# Altium project Automated Component Testing PCB.PrjPcb (part 1 of 2)
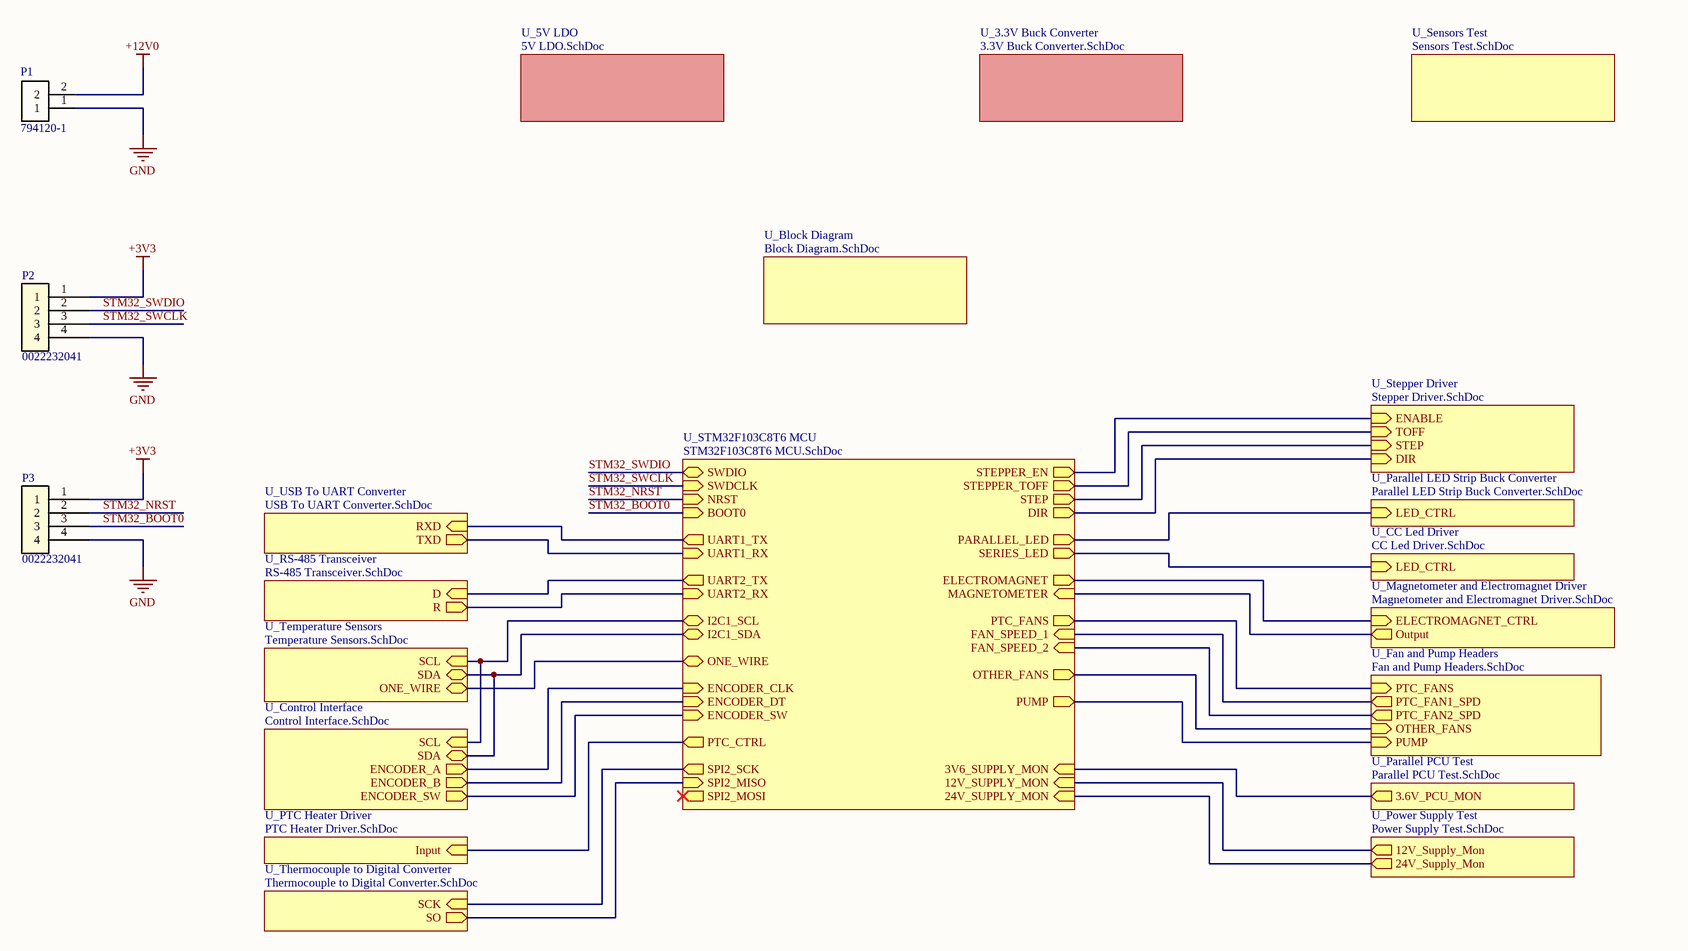
[diagram p0: Main.SchDoc]
Revision: A; Author: Hany Hamza
19 sheets, 184 parts. Net scope: hierarchical (ports join the sheet entries above them; power ports are global).
Board file: Component Testing PCB.PcbDoc
Sheets:
  Main.SchDoc
    U_3.3V Buck Converter = 3.3V Buck Converter.SchDoc
    U_5V LDO = 5V LDO.SchDoc
    U_Block Diagram = Block Diagram.SchDoc
    U_CC Led Driver = CC Led Driver.SchDoc
    U_Control Interface = Control Interface.SchDoc
    U_Fan and Pump Headers = Fan and Pump Headers.SchDoc
    U_Magnetometer and Electromagnet Driver = Magnetometer and Electromagnet Driver.SchDoc
    U_Parallel LED Strip Buck Converter = Parallel LED Strip Buck Converter.SchDoc
    U_Parallel PCU Test = Parallel PCU Test.SchDoc
    U_Power Supply Test = Power Supply Test.SchDoc
    U_PTC Heater Driver = PTC Heater Driver.SchDoc
    U_RS-485 Transceiver = RS-485 Transceiver.SchDoc
    U_Sensors Test = Sensors Test.SchDoc
    U_Stepper Driver = Stepper Driver.SchDoc
    U_STM32F103C8T6 MCU = STM32F103C8T6 MCU.SchDoc
    U_Temperature Sensors = Temperature Sensors.SchDoc
    U_Thermocouple to Digital Converter = Thermocouple to Digital Converter.SchDoc
    U_USB To UART Converter = USB To UART Converter.SchDoc

## Sheet Main.SchDoc
size 381 x 241 mm; SheetNumber: 1; SheetTotal: 19

### Parts
P1  794120-1  [POWER2-5.08 right angle]
P2  0022232041  [Signal4]
P3  0022232041  [Signal4]

### Sub-sheets
U_3.3V Buck Converter = 3.3V Buck Converter.SchDoc: no entries
U_5V LDO = 5V LDO.SchDoc: no entries
U_Block Diagram = Block Diagram.SchDoc: no entries
U_CC Led Driver = CC Led Driver.SchDoc: LED_CTRL (in)
U_Control Interface = Control Interface.SchDoc: SCL (in), SDA (bidir), ENCODER_A (out), ENCODER_B (out), ENCODER_SW (out)
U_Fan and Pump Headers = Fan and Pump Headers.SchDoc: PTC_FAN1_SPD (out), PTC_FAN2_SPD (out), PTC_FANS (in), OTHER_FANS (in), PUMP (in)
U_Magnetometer and Electromagnet Driver = Magnetometer and Electromagnet Driver.SchDoc: Output (out), ELECTROMAGNET_CTRL (in)
U_Parallel LED Strip Buck Converter = Parallel LED Strip Buck Converter.SchDoc: LED_CTRL (in)
U_Parallel PCU Test = Parallel PCU Test.SchDoc: 3.6V_PCU_MON (out)
U_Power Supply Test = Power Supply Test.SchDoc: 12V_Supply_Mon (out), 24V_Supply_Mon (out)
U_PTC Heater Driver = PTC Heater Driver.SchDoc: Input (in)
U_RS-485 Transceiver = RS-485 Transceiver.SchDoc: R (out), D (in)
U_Sensors Test = Sensors Test.SchDoc: no entries
U_Stepper Driver = Stepper Driver.SchDoc: ENABLE (in), STEP (in), DIR (in), TOFF (in)
U_STM32F103C8T6 MCU = STM32F103C8T6 MCU.SchDoc: SWDIO (bidir), SWDCLK (in), NRST (in), BOOT0 (in), UART1_TX (out), UART2_TX (out), UART1_RX (in), UART2_RX (in), STEP (out), DIR (out), STEPPER_EN (out), STEPPER_TOFF (out), I2C1_SDA (bidir), I2C1_SCL (bidir), 12V_SUPPLY_MON (in), 24V_SUPPLY_MON (in), 3V6_SUPPLY_MON (in), ONE_WIRE (bidir), MAGNETOMETER (in), SPI2_SCK (out), SPI2_MOSI (out), SPI2_MISO (in), PARALLEL_LED (out), SERIES_LED (out), ELECTROMAGNET (out), PTC_FANS (out), PUMP (out), FAN_SPEED_1 (in), FAN_SPEED_2 (in), ENCODER_CLK (in), ENCODER_DT (in), ENCODER_SW (in), OTHER_FANS (out), PTC_CTRL (out)
U_Temperature Sensors = Temperature Sensors.SchDoc: SCL (in), SDA (bidir), ONE_WIRE (bidir)
U_Thermocouple to Digital Converter = Thermocouple to Digital Converter.SchDoc: SCK (in), SO (out)
U_USB To UART Converter = USB To UART Converter.SchDoc: RXD (in), TXD (out)

### Nets
+3V3: P2.1 P3.1
+12V0: P1.2
GND: P1.1 P2.4 P3.4
+3V6_MON: sheet U_Parallel PCU Test/3.6V_PCU_MON, sheet U_STM32F103C8T6 MCU/3V6_SUPPLY_MON
+12V_MON: sheet U_Power Supply Test/12V_Supply_Mon, sheet U_STM32F103C8T6 MCU/12V_SUPPLY_MON
+24V_MON: sheet U_Power Supply Test/24V_Supply_Mon, sheet U_STM32F103C8T6 MCU/24V_SUPPLY_MON
DRV_DIR: sheet U_Stepper Driver/DIR, sheet U_STM32F103C8T6 MCU/DIR
DRV_EN: sheet U_Stepper Driver/ENABLE, sheet U_STM32F103C8T6 MCU/STEPPER_EN
DRV_STP: sheet U_Stepper Driver/STEP, sheet U_STM32F103C8T6 MCU/STEP
DRV_TOFF: sheet U_Stepper Driver/TOFF, sheet U_STM32F103C8T6 MCU/STEPPER_TOFF
EM_FET: sheet U_Magnetometer and Electromagnet Driver/ELECTROMAGNET_CTRL, sheet U_STM32F103C8T6 MCU/ELECTROMAGNET
ENCODER_A: sheet U_Control Interface/ENCODER_A, sheet U_STM32F103C8T6 MCU/ENCODER_CLK
ENCODER_B: sheet U_Control Interface/ENCODER_B, sheet U_STM32F103C8T6 MCU/ENCODER_DT
ENCODER_SW: sheet U_Control Interface/ENCODER_SW, sheet U_STM32F103C8T6 MCU/ENCODER_SW
I2C_SCL: sheet U_Control Interface/SCL, sheet U_STM32F103C8T6 MCU/I2C1_SCL, sheet U_Temperature Sensors/SCL
I2C_SDA: sheet U_Control Interface/SDA, sheet U_STM32F103C8T6 MCU/I2C1_SDA, sheet U_Temperature Sensors/SDA
MAG_OUT: sheet U_Magnetometer and Electromagnet Driver/Output, sheet U_STM32F103C8T6 MCU/MAGNETOMETER
ONE_WIRE: sheet U_STM32F103C8T6 MCU/ONE_WIRE, sheet U_Temperature Sensors/ONE_WIRE
OTHER_FANS: sheet U_Fan and Pump Headers/OTHER_FANS, sheet U_STM32F103C8T6 MCU/OTHER_FANS
PTC_FAN1_SPD: sheet U_Fan and Pump Headers/PTC_FAN1_SPD, sheet U_STM32F103C8T6 MCU/FAN_SPEED_1
PTC_FAN2_SPD: sheet U_Fan and Pump Headers/PTC_FAN2_SPD, sheet U_STM32F103C8T6 MCU/FAN_SPEED_2
PTC_FANS: sheet U_Fan and Pump Headers/PTC_FANS, sheet U_STM32F103C8T6 MCU/PTC_FANS
PUMP_CTRL: sheet U_Fan and Pump Headers/PUMP, sheet U_STM32F103C8T6 MCU/PUMP
RELAY_FET: sheet U_PTC Heater Driver/Input, sheet U_STM32F103C8T6 MCU/PTC_CTRL
RS_D: sheet U_RS-485 Transceiver/D, sheet U_STM32F103C8T6 MCU/UART2_TX
RS_R: sheet U_RS-485 Transceiver/R, sheet U_STM32F103C8T6 MCU/UART2_RX
SCK: sheet U_STM32F103C8T6 MCU/SPI2_SCK, sheet U_Thermocouple to Digital Converter/SCK
SO: sheet U_STM32F103C8T6 MCU/SPI2_MISO, sheet U_Thermocouple to Digital Converter/SO
STM32_BOOT0: P3.3 ; sheet U_STM32F103C8T6 MCU/BOOT0
STM32_NRST: P3.2 ; sheet U_STM32F103C8T6 MCU/NRST
STM32_SWCLK: P2.3 ; sheet U_STM32F103C8T6 MCU/SWDCLK
STM32_SWDIO: P2.2 ; sheet U_STM32F103C8T6 MCU/SWDIO
UART1_RX: sheet U_STM32F103C8T6 MCU/UART1_RX, sheet U_USB To UART Converter/TXD
UART1_TX: sheet U_STM32F103C8T6 MCU/UART1_TX, sheet U_USB To UART Converter/RXD
NetTP2_1: sheet U_Parallel LED Strip Buck Converter/LED_CTRL, sheet U_STM32F103C8T6 MCU/PARALLEL_LED
NetTP29_1: sheet U_CC Led Driver/LED_CTRL, sheet U_STM32F103C8T6 MCU/SERIES_LED

### Notes on the sheet
- Project:
- Sheet Title:
- Size
- Date:
- A
- Sheet Number:
- Sheet Total:
- Revision:
- Time:
- Author:

### Library data of the parts
P1 = Power2: PCB Mount Header, Right Angle, Wire-to-Board, 2 Position, 5.08 mm [.2 in] Centerline, Fully Shrouded, Pre-Tin, Commercial MATE-N-LOK; MP: TE Connectivity; MF: 794120-1; ComponentLink1Description: Datasheet; ComponentLink1URL: https://www.te.com/commerce/DocumentDelivery/DDEController?Action=srchrtrv&DocNm=114-1012&DocType=Specification%20Or%20Standard&DocLang=English&DocFormat=pdf&PartCntxt=794120-1; ComponentLink2Description: Supplier1
P2 P3 = Signal4: SignalConnector, 4 leads; MF: Molex; ComponentLink1Description: Datasheet; ComponentLink1URL: https://tools.molex.com/pdm_docs/ps/PS-10-07-001.pdf; ComponentLink2Description: Supplier1; ComponentLink2URL: https://www.digikey.com/en/products/detail/molex/0022232041/26671; MP: 0022232041

## Sheet 3.3V Buck Converter.SchDoc
size A; SheetNumber: 4; SheetTotal: 19
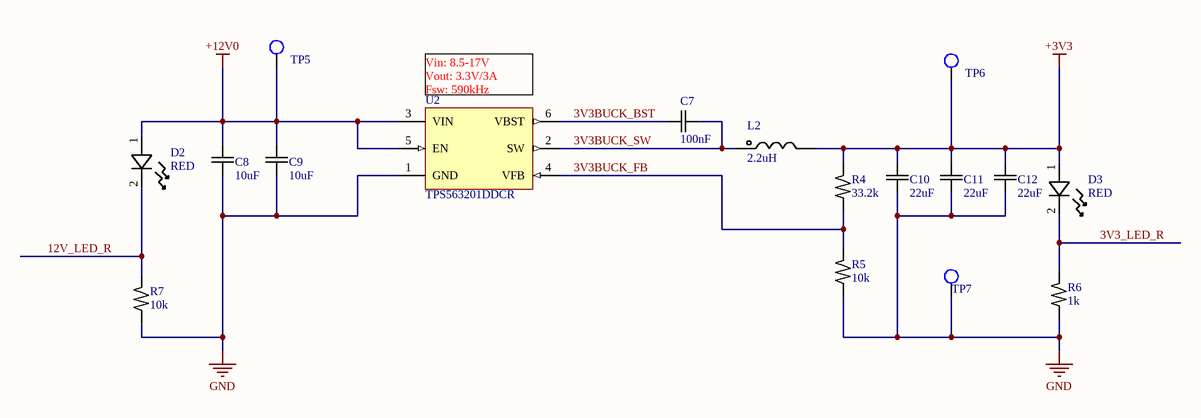
[diagram p1: 3.3V Buck Converter.SchDoc]

### Parts
C7  100nF  [C0603]
C8  10uF  [C1206]
C9  10uF  [C1206]
C10  22uF  [C1206]
C11  22uF  [C1206]
C12  22uF  [C1206]
D2  RED  [LED0805 RED]
D3  RED  [LED0805 RED]
L2  2.2uH  [Coil 7.2x6.6]
R4  33.2k  [R0603]
R5  10k  [R0603]
R6  1k  [R0603]
R7  10k  [R0603]
TP5  TestPoint  [TESTPOINT_SMD_1.27MM]  (value not drawn)  (no BOM)
TP6  TestPoint  [TESTPOINT_SMD_1.27MM]  (value not drawn)  (no BOM)
TP7  TestPoint  [TESTPOINT_SMD_1.27MM]  (value not drawn)  (no BOM)
U2  TPS563201DDCR  [SOT23-6]

### Nets
+3V3: C10.1 C11.1 C12.1 D3.1 L2.2 R4.2 TP6.1
+12V0: C8.2 C9.2 D2.1 TP5.1 U2.3(VIN) U2.5(EN)
GND: C8.1 C9.1 C10.2 C11.2 C12.2 R5.1 R6.1 R7.1 TP7.1 U2.1(GND)
3V3_LED_R: D3.2 R6.2
3V3BUCK_BST: C7.1 U2.6(VBST)
3V3BUCK_FB: R4.1 R5.2 U2.4(VFB)
3V3BUCK_SW: C7.2 L2.1 U2.2(SW)
12V_LED_R: D2.2 R7.2

### Notes on the sheet
- (near U2) Vin: 8.5-17V
  Vout: 3.3V/3A
  Fsw: 590kHz
- Project:
- Sheet Title:
- Size
- Date:
- A
- Sheet Number:
- Sheet Total:
- Revision:
- Time:
- Author:

### Library data of the parts
C7 = Cap_cer: CAP CER 100nF 50V X7R 0603; MF: HRE; MP: CGA0603X7R104K500JT; ComponentLink1Description: Datasheet; ComponentLink1URL: https://www.lcsc.com/datasheet/C6119867.pdf; ComponentLink2Description: Supplier1; ComponentLink2URL: https://www.lcsc.com/product-detail/C6119867.html
C8 C9 = Cap_cer: CAP CER 10uF 25V X7R 1206; MF: SAMWHA; MP: CS3216X7R106K250NRI; ComponentLink1Description: Datasheet; ComponentLink1URL: https://www.lcsc.com/datasheet/C513767.pdf; ComponentLink2Description: Supplier1; ComponentLink2URL: https://www.lcsc.com/product-detail/C513767.html
C10-C12 = Cap_cer: CAP CER 22uF 10V X7R 1206; MF: CCTC; MP: TCC1206X7R226K100HT; ComponentLink1Description: Datasheet; ComponentLink1URL: https://www.lcsc.com/datasheet/C20416445.pdf; ComponentLink2Description: Supplier1; ComponentLink2URL: https://www.lcsc.com/product-detail/C20416445.html
D2 D3 = LED: LED RED WATER CLEAR 0805 SMD; MF: XINGLIGHT; MP: XL-TD2012SURC; ComponentLink1Description: Datasheet; ComponentLink1URL: https://www.lcsc.com/datasheet/C5349939.pdf; ComponentLink2Description: Supplier1; ComponentLink2URL: https://www.lcsc.com/product-detail/C5349939.html
L2 = Coil: FIXED IND 2.2uH 9.5A 11.2mΩ SMD,7.2x6.6mm; MF: SHOU HAN; MP: CYA0650-2.2UH; ComponentLink1Description: Datasheet; ComponentLink1URL: https://www.lcsc.com/datasheet/C5189752.pdf; ComponentLink2Description: Supplier1; ComponentLink2URL: https://www.lcsc.com/product-detail/C5189752.html
R4 = Res: RES 33.2kΩ ±1% 100mW 0603; MF: FOJAN; MP: FRC0603F3322TS; ComponentLink1Description: Datasheet; ComponentLink1URL: https://www.lcsc.com/datasheet/C2933200.pdf; ComponentLink2Description: Supplier1; ComponentLink2URL: https://www.lcsc.com/product-detail/C2933200.html
R5 R7 = Res: RES 10kΩ ±1% 100mW 0603; MF: FOJAN; MP: FRC0603F1002TS; ComponentLink1Description: Datasheet; ComponentLink1URL: https://www.lcsc.com/datasheet/C2906982.pdf; ComponentLink2Description: Supplier1; ComponentLink2URL: https://www.lcsc.com/product-detail/C2906982.html
R6 = Res: RES 1kΩ ±5% 100mW 0603; MF: VO; MP: SCR0603J1K; ComponentLink1Description: Datasheet; ComponentLink1URL: https://www.lcsc.com/datasheet/C3017736.pdf; ComponentLink2Description: Supplier1; ComponentLink2URL: https://www.lcsc.com/product-detail/C3017736.html
U2 = TPS563201DDCR: 580kHz 3A Buck Adjustable 768mV~7V 1 SOT-23-THIN-6 Voltage Regulators - DC DC Switching Regulators ROHS; MF: Texas Instruments; ComponentLink1Description: Datasheet; ComponentLink1URL: https://www.lcsc.com/datasheet/C116592.pdf; ComponentLink2Description: Supplier1; ComponentLink2URL: https://www.lcsc.com/product-detail/C116592.html; MP: TPS563201DDCR

## Sheet 5V LDO.SchDoc
size A; SheetNumber: 7; SheetTotal: 19
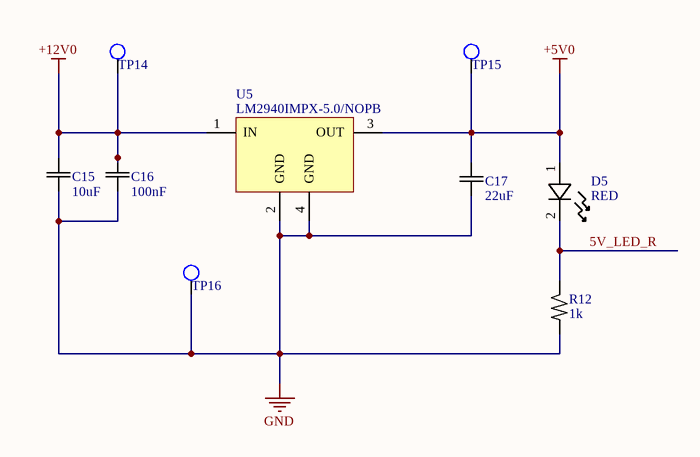
[diagram p2: 5V LDO.SchDoc]

### Parts
C15  10uF  [C1206]
C16  100nF  [C0603]
C17  22uF  [C1206]
D5  RED  [LED0805 RED]
R12  1k  [R0603]
TP14  TestPoint  [TESTPOINT_SMD_1.27MM]  (value not drawn)  (no BOM)
TP15  TestPoint  [TESTPOINT_SMD_1.27MM]  (value not drawn)  (no BOM)
TP16  TestPoint  [TESTPOINT_SMD_1.27MM]  (value not drawn)  (no BOM)
U5  LM2940IMPX-5.0/NOPB  [SOT-223]

### Nets
+5V0: C17.1 D5.1 TP15.1 U5.3(OUT)
+12V0: C15.2 C16.2 TP14.1 U5.1(IN)
GND: C15.1 C16.1 C17.2 R12.1 TP16.1 U5.2(GND) U5.4(GND)
5V_LED_R: D5.2 R12.2

### Notes on the sheet
- Project:
- Sheet Title:
- Size
- Date:
- A
- Sheet Number:
- Sheet Total:
- Revision:
- Time:
- Author:

### Library data of the parts
C15 = Cap_cer: as C8 on sheet 3.3V Buck Converter; ComponentLink1Description: Datasheet; ComponentLink1URL: https://www.lcsc.com/datasheet/C513767.pdf; ComponentLink2Description: Supplier1; ComponentLink2URL: https://www.lcsc.com/product-detail/C513767.html
C16 = Cap_cer: as C7 on sheet 3.3V Buck Converter; ComponentLink1Description: Datasheet; ComponentLink1URL: https://www.lcsc.com/datasheet/C6119867.pdf; ComponentLink2Description: Supplier1; ComponentLink2URL: https://www.lcsc.com/product-detail/C6119867.html
C17 = Cap_cer: as C10 on sheet 3.3V Buck Converter; ComponentLink1Description: Datasheet; ComponentLink1URL: https://www.lcsc.com/datasheet/C20416445.pdf; ComponentLink2Description: Supplier1; ComponentLink2URL: https://www.lcsc.com/product-detail/C20416445.html
D5 = LED: as D2 on sheet 3.3V Buck Converter; ComponentLink1Description: Datasheet; ComponentLink1URL: https://www.lcsc.com/datasheet/C5349939.pdf; ComponentLink2Description: Supplier1; ComponentLink2URL: https://www.lcsc.com/product-detail/C5349939.html
R12 = Res: as R6 on sheet 3.3V Buck Converter; ComponentLink1Description: Datasheet; ComponentLink1URL: https://www.lcsc.com/datasheet/C3017736.pdf; ComponentLink2Description: Supplier1; ComponentLink2URL: https://www.lcsc.com/product-detail/C3017736.html
U5 = LM2940IMPX-5.0/NOPB: 72dB@(120Hz) Positive Fixed 5V SOT-223-4 Voltage Regulators - Linear, Low Drop Out (LDO) Regulators ROHS; MF: Texas Instruments; MP: LM2940IMPX-5.0/NOPB; ComponentLink1Description: Datasheet; ComponentLink1URL: https://www.lcsc.com/datasheet/C2859859.pdf; ComponentLink2Description: Supplier1; ComponentLink2URL: https://www.lcsc.com/product-detail/C2859859.html

## Sheet Block Diagram.SchDoc
size A; SheetNumber: 2; SheetTotal: 18
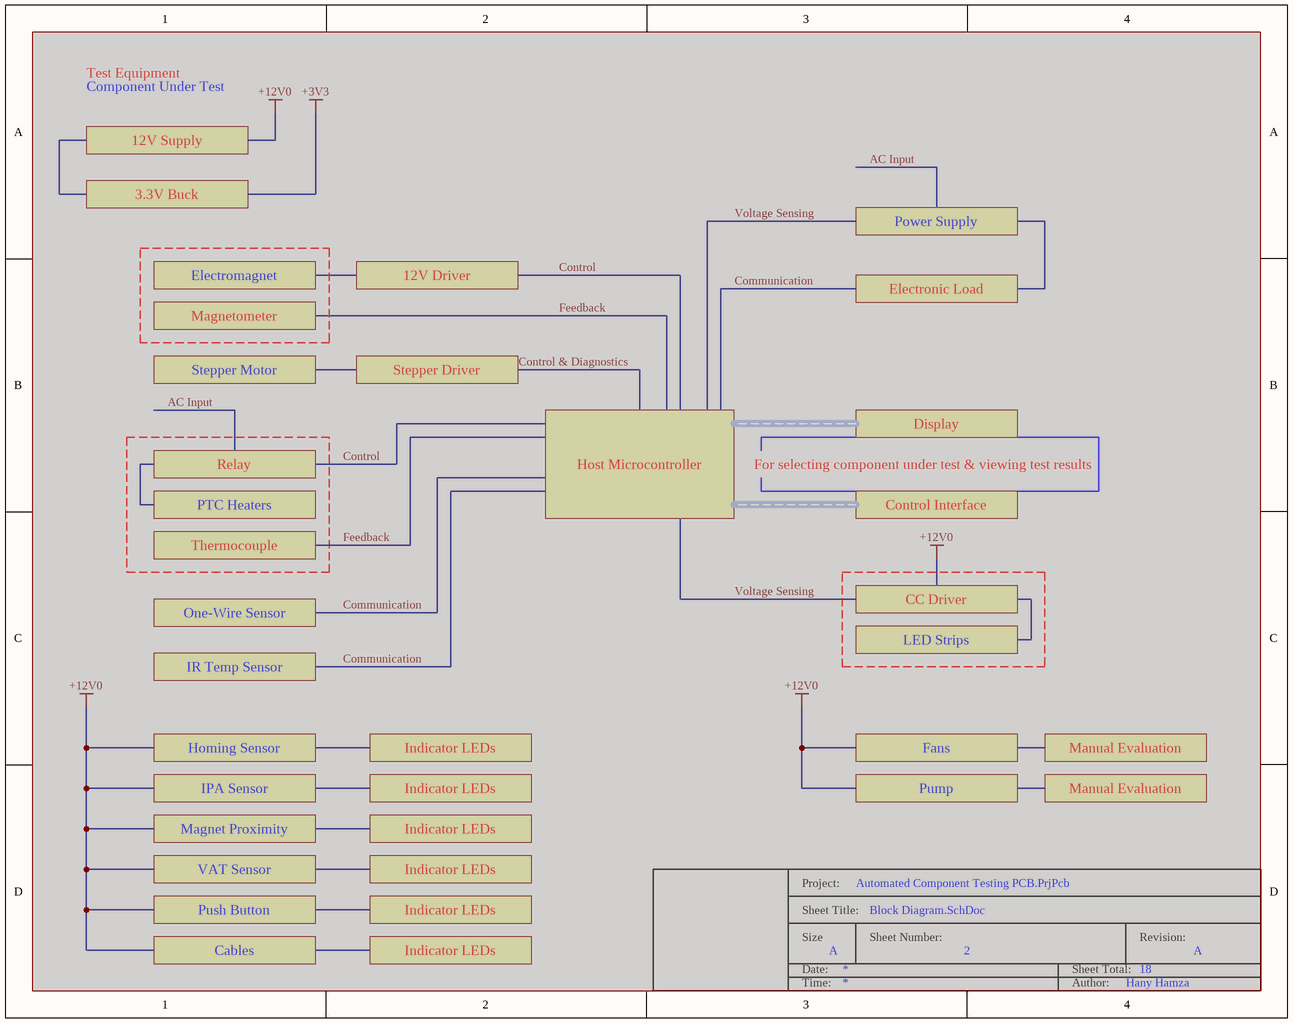
[diagram p3: Block Diagram.SchDoc]

### Notes on the sheet
- Test Equipment
- Component Under Test
- 12V Supply
- 3.3V Buck
- Power Supply
- Electromagnet
- 12V Driver
- Electronic Load
- Stepper Motor
- Magnetometer
- Stepper Driver
- Display
- PTC Heaters
- Relay
- Host Microcontroller
- For selecting component under test & viewing test results
- Control Interface
- Thermocouple
- One-Wire Sensor
- LED Strips
- CC Driver
- IR Temp Sensor
- Homing Sensor
- Indicator LEDs
- Fans
- Manual Evaluation
- IPA Sensor
- Magnet Proximity
- Pump
- VAT Sensor
- Push Button
- Cables
- Project:
- Sheet Title:
- Size
- Date:
- A
- Sheet Number:
- Sheet Total:
- Revision:
- Time:
- Author:

## Sheet CC Led Driver.SchDoc
size A; SheetNumber: 11; SheetTotal: 19
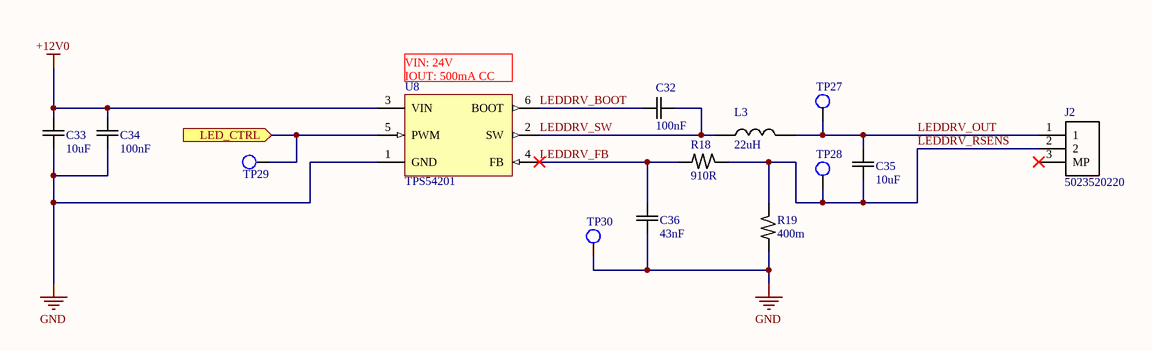
[diagram p4: CC Led Driver.SchDoc]

### Parts
C32  100nF  [C0603]
C33  10uF  [C1206]
C34  100nF  [C0603]
C35  10uF  [C1206]
C36  43nF  [C0603]
J2  5023520220  [5600200220]
L3  22uH  [Coil 9.7x9.2]
R18  910R  [R0603]
R19  400m  [R1206]
TP27  TestPoint  [TESTPOINT_SMD_1.27MM]  (value not drawn)  (no BOM)
TP28  TestPoint  [TESTPOINT_SMD_1.27MM]  (value not drawn)  (no BOM)
TP29  TestPoint  [TESTPOINT_SMD_1.27MM]  (value not drawn)  (no BOM)
TP30  TestPoint  [TESTPOINT_SMD_1.27MM]  (value not drawn)  (no BOM)
U8  TPS54201  [SOT23-6]

### Ports
LED_CTRL (in)

### Nets
+12V0: C33.2 C34.2 U8.3(VIN)
GND: C33.1 C34.1 C36.2 R19.1 TP30.1 U8.1(GND)
LEDDRV_BOOT: C32.2 U8.6(BOOT)
LEDDRV_FB: C36.1 R18.1 U8.4(FB)
LEDDRV_OUT: C35.1 J2.1 L3.2 TP27.1
LEDDRV_RSENS: C35.2 J2.2 R18.2 R19.2 TP28.1
LEDDRV_SW: C32.1 L3.1 U8.2(SW)
NetTP29_1: TP29.1 U8.5(PWM) ; port LED_CTRL

Not connected (* = marked no-connect by the designer): J2 3(MP)*

### Notes on the sheet
- (near U8) VIN: 24V
  IOUT: 500mA CC
- Project:
- Sheet Title:
- Size
- Date:
- A
- Sheet Number:
- Sheet Total:
- Revision:
- Time:
- Author:

### Library data of the parts
C32 C34 = Cap_cer: as C7 on sheet 3.3V Buck Converter; ComponentLink1Description: Datasheet; ComponentLink1URL: https://www.lcsc.com/datasheet/C6119867.pdf; ComponentLink2Description: Supplier1; ComponentLink2URL: https://www.lcsc.com/product-detail/C6119867.html
C33 C35 = Cap_cer: as C8 on sheet 3.3V Buck Converter; ComponentLink1Description: Datasheet; ComponentLink1URL: https://www.lcsc.com/datasheet/C513767.pdf; ComponentLink2Description: Supplier1; ComponentLink2URL: https://www.lcsc.com/product-detail/C513767.html
C36 = Cap_cer: CAP CER 0.047UF 50V X7R 0603; MF: Yageo; MP: CC0603JRX7R9BB473; ComponentLink1Description: Datasheet; ComponentLink1URL: *; ComponentLink2Description: Supplier1; ComponentLink2URL: *
J2 = 5023520202: White 2P 1x2P Tin 2mm Copper Alloy 125V 2 3A 1 Surface Mount,Vertical SMD,P=2mm Headers, Male Pins ROHS; MF: MOLEX; MP: 5600200220; ComponentLink1Description: Supplier 1; ComponentLink1URL: https://www.lcsc.com/product-detail/C114092.html?s_z=n_5600200220; ComponentLink2Description: Datasheet; ComponentLink2URL: https://www.molex.com/content/dam/molex/molex-dot-com/products/automated/en-us/salesdrawingpdf/560/560020/5600200220_sd.pdf?inline\
L3 = Coil: FIXED IND 22uH 3A 130mΩ SMD,6.6x7.1mm; MF: YJYCOIN; MP: YSPI0630A-220M; ComponentLink1Description: Datasheet; ComponentLink1URL: https://www.lcsc.com/datasheet/C497873.pdf; ComponentLink2Description: Supplier1; ComponentLink2URL: https://www.lcsc.com/product-detail/C497873.html
R18 = Res: RES 910 OHM 1% 1/10W 0603; MF: Yageo; MP: RC0603FR-07910RL; ComponentLink1Description: Datasheet; ComponentLink1URL: *; ComponentLink2Description: Supplier1; ComponentLink2URL: *
R19 = Res: 400mΩ 1W ±100ppm/℃ Thin Film Resistor ±1% 1206 Chip Resistor - Surface Mount ROHS; MF: Milliohm; MP: HoJLRH1206-1W-400mR-1%; ComponentLink1Description: Datasheet; ComponentLink1URL: https://www.lcsc.com/datasheet/C46594300.pdf; ComponentLink2Description: Supplier1; ComponentLink2URL: https://www.lcsc.com/product-detail/C46594300.html
U8 = TPS54201: IC REG BUCK ADJ 1.5A TSOT23-6; MP: TPS54201DDCR; MF: Texas Instruments; ComponentLink1Description: Supplier 1; ComponentLink1URL: https://www.digikey.com/en/products/detail/texas-instruments/TPS54201DDCR/8133010; ComponentLink2Description: Datasheet; ComponentLink2URL: https://www.ti.com/lit/ds/symlink/tps54201.pdf

## Sheet Control Interface.SchDoc
size A; SheetNumber: 19; SheetTotal: 19
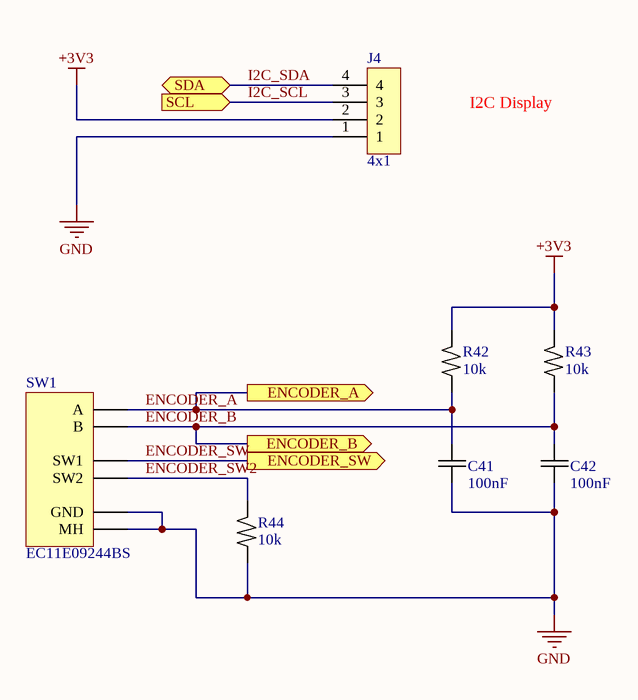
[diagram p5: Control Interface.SchDoc]

### Parts
C41  100nF  [C0603]
C42  100nF  [C0603]
J4  4x1  [Female Header 4x1 2.54mm]
R42  10k  [R0603]
R43  10k  [R0603]
R44  10k  [R0603]
SW1  EC11E09244BS  [EC11E09244BS Encoder]

### Ports
ENCODER_A (out), ENCODER_B (out), ENCODER_SW (out), SCL (in), SDA (bidir)

### Nets
+3V3: J4.2 R42.2 R43.2
GND: C41.1 C42.1 J4.1 R44.1 SW1.C(GND) SW1.MH
ENCODER_A: C41.2 R42.1 SW1.A ; port ENCODER_A
ENCODER_B: C42.2 R43.1 SW1.B ; port ENCODER_B
ENCODER_SW: SW1.D(SW1) ; port ENCODER_SW
ENCODER_SW2: R44.2 SW1.E(SW2)
I2C_SCL: J4.3 ; port SCL
I2C_SDA: J4.4 ; port SDA

### Notes on the sheet
- I2C Display
- Project:
- Sheet Title:
- Size
- Date:
- A
- Sheet Number:
- Sheet Total:
- Revision:
- Time:
- Author:

### Library data of the parts
C41 C42 = Cap_cer: as C7 on sheet 3.3V Buck Converter; ComponentLink1Description: Datasheet; ComponentLink1URL: https://www.lcsc.com/datasheet/C6119867.pdf; ComponentLink2Description: Supplier1; ComponentLink2URL: https://www.lcsc.com/product-detail/C6119867.html
J4 = Pin Header Female 4x1 2.54mm: CONN SOCKET 4POS 2.54mm SINGLE ROW TH; MF: BOOMELE(Boom Precision Elec); MP: 2.54-1*4P; ComponentLink1Description: Datasheet; ComponentLink1URL: https://www.lcsc.com/datasheet/C2718488.pdf; ComponentLink2Description: Supplier1; ComponentLink2URL: https://www.lcsc.com/product-detail/C2718488.html
R42-R44 = Res: as R5 on sheet 3.3V Buck Converter; ComponentLink1Description: Datasheet; ComponentLink1URL: https://www.lcsc.com/datasheet/C2906982.pdf; ComponentLink2Description: Supplier1; ComponentLink2URL: https://www.lcsc.com/product-detail/C2906982.html
SW1 = EC11E09244BS Encoder: Through Hole Encoders RoHS; MF: ALPSALPINE; MP: EC11E09244BS; ComponentLink1Description: Supplier1; ComponentLink1URL: https://www.lcsc.com/product-detail/C470742.html; ComponentLink2Description: Datasheet; ComponentLink2URL: https://www.lcsc.com/datasheet/C470742.pdf

## Sheet Fan and Pump Headers.SchDoc
size A; SheetNumber: 12; SheetTotal: 19
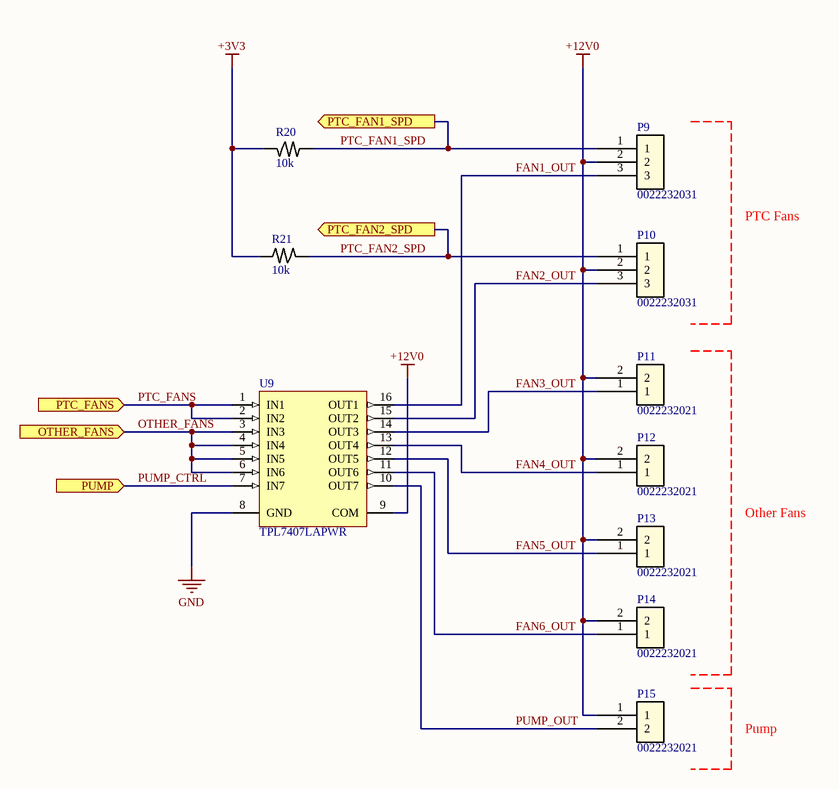
[diagram p6: Fan and Pump Headers.SchDoc]

### Parts
P9  0022232031  [Signal3]
P10  0022232031  [Signal3]
P11  0022232021  [Signal2]
P12  0022232021  [Signal2]
P13  0022232021  [Signal2]
P14  0022232021  [Signal2]
P15  0022232021  [Signal2]
R20  10k  [R0603]
R21  10k  [R0603]
U9  TPL7407LAPWR  [TSSOP-16]

### Ports
OTHER_FANS (in), PTC_FAN1_SPD (out), PTC_FAN2_SPD (out), PTC_FANS (in), PUMP (in)

### Nets
+3V3: R20.2 R21.1
+12V0: P9.2 P10.2 P11.2 P12.2 P13.2 P14.2 P15.1 U9.9(COM)
GND: U9.8(GND)
FAN1_OUT: P9.3 U9.16(OUT1)
FAN2_OUT: P10.3 U9.15(OUT2)
FAN3_OUT: P11.1 U9.14(OUT3)
FAN4_OUT: P12.1 U9.13(OUT4)
FAN5_OUT: P13.1 U9.12(OUT5)
FAN6_OUT: P14.1 U9.11(OUT6)
OTHER_FANS: U9.3(IN3) U9.4(IN4) U9.5(IN5) U9.6(IN6) ; port OTHER_FANS
PTC_FAN1_SPD: P9.1 R20.1 ; port PTC_FAN1_SPD
PTC_FAN2_SPD: P10.1 R21.2 ; port PTC_FAN2_SPD
PTC_FANS: U9.1(IN1) U9.2(IN2) ; port PTC_FANS
PUMP_CTRL: U9.7(IN7) ; port PUMP
PUMP_OUT: P15.2 U9.10(OUT7)

### Notes on the sheet
- PTC Fans
- Other Fans
- Pump
- Project:
- Sheet Title:
- Size
- Date:
- A
- Sheet Number:
- Sheet Total:
- Revision:
- Time:
- Author:

### Library data of the parts
P9 P10 = Signal3: SignalConnector, 3 leads; MF: Molex; MP: 0022232031; ComponentLink1Description: Datasheet; ComponentLink1URL: https://tools.molex.com/pdm_docs/sd/022232031_sd.pdf; ComponentLink2Description: Supplier1; ComponentLink2URL: https://www.digikey.com/en/products/detail/molex/0022232031/26669
P11-P15 = Signal2: SignalConnector, 2 leads; MF: Molex; ComponentLink1Description: Datasheet; ComponentLink1URL: https://www.molex.com/content/dam/molex/molex-dot-com/products/automated/en-us/salesdrawingpdf/637/6373/022232021_sd.pdf?inline; ComponentLink2Description: Supplier1; ComponentLink2URL: https://www.digikey.com/en/products/detail/molex/0022232021/26667; MP: 0022232021
R20 R21 = Res: as R5 on sheet 3.3V Buck Converter; ComponentLink1Description: Datasheet; ComponentLink1URL: https://www.lcsc.com/datasheet/C2906982.pdf; ComponentLink2Description: Supplier1; ComponentLink2URL: https://www.lcsc.com/product-detail/C2906982.html
U9 = TPL7407LAPWR FET Array: 7 Active High Low Side Switch TSSOP-16 Power Distribution Switches, Load Drivers ROHS; MF: Texas Instruments; ComponentLink1Description: Datasheet; ComponentLink1URL: https://www.ti.com/lit/ds/symlink/tpl7407la.pdf?ts=1759164854652&ref_url=https%253A%252F%252Fwww.google.com%252F; ComponentLink2Description: Supplier1; ComponentLink2URL: https://www.lcsc.com/product-detail/C2149827.html?s_z=n_tpl7407la; MP: TPL7407LAPWR

## Sheet Magnetometer and Electromagnet Driver.SchDoc
size A; SheetNumber: 6; SheetTotal: 19
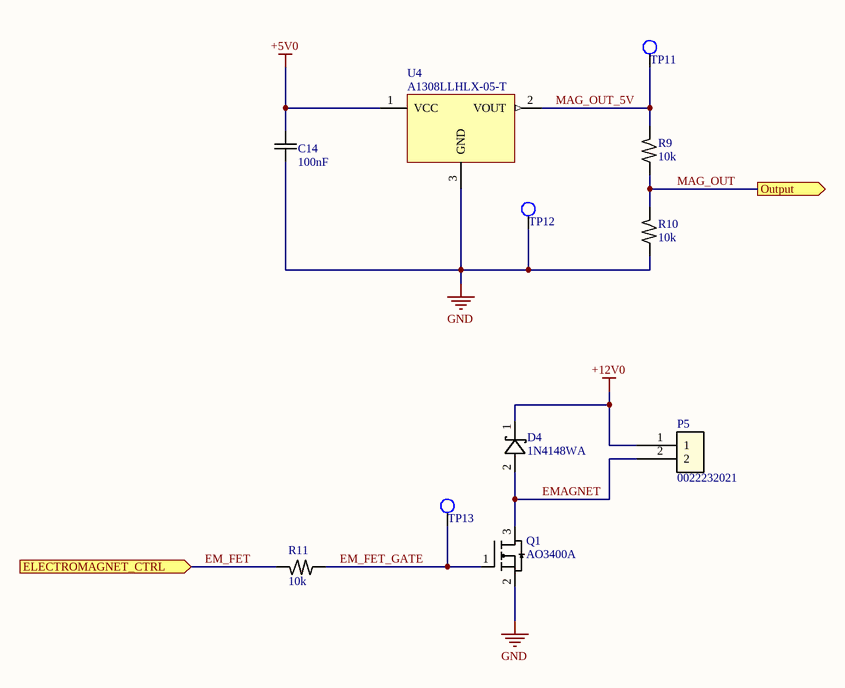
[diagram p7: Magnetometer and Electromagnet Driver.SchDoc]

### Parts
C14  100nF  [C0603]
D4  1N4148WA  [SOD-123W]
P5  0022232021  [Signal2]
Q1  AO3400A  [SOT23-3]
R9  10k  [R0603]
R10  10k  [R0603]
R11  10k  [R0603]
TP11  TestPoint  [TESTPOINT_SMD_1.27MM]  (value not drawn)  (no BOM)
TP12  TestPoint  [TESTPOINT_SMD_1.27MM]  (value not drawn)  (no BOM)
TP13  TestPoint  [TESTPOINT_SMD_1.27MM]  (value not drawn)  (no BOM)
U4  A1308LLHLX-05-T  [SOT23-3]

### Ports
ELECTROMAGNET_CTRL (in), Output (out)

### Nets
+5V0: C14.2 U4.1(VCC)
+12V0: D4.1 P5.1
GND: C14.1 Q1.2(G) R10.1 TP12.1 U4.3(GND)
EM_FET: R11.2 ; port ELECTROMAGNET_CTRL
EM_FET_GATE: Q1.1(G) R11.1 TP13.1
EMAGNET: D4.2 P5.2 Q1.3(G)
MAG_OUT: R9.1 R10.2 ; port Output
MAG_OUT_5V: R9.2 TP11.1 U4.2(VOUT)

### Notes on the sheet
- Project:
- Sheet Title:
- Size
- Date:
- A
- Sheet Number:
- Sheet Total:
- Revision:
- Time:
- Author:

### Library data of the parts
C14 = Cap_cer: as C7 on sheet 3.3V Buck Converter; ComponentLink1Description: Datasheet; ComponentLink1URL: https://www.lcsc.com/datasheet/C6119867.pdf; ComponentLink2Description: Supplier1; ComponentLink2URL: https://www.lcsc.com/product-detail/C6119867.html
D4 = PMEG4020ETR-QX: DIODE GP 75V 150mA SOD-123W; MF: PJSEMI; MP: 1N4148WA; ComponentLink1Description: Datasheet; ComponentLink1URL: https://www.lcsc.com/datasheet/C2977359.pdf; ComponentLink2Description: Supplier1; ComponentLink2URL: https://www.lcsc.com/product-detail/C2977359.html
P5 = Signal2: SignalConnector, 2 leads; MF: Molex; ComponentLink1Description: Datasheet; ComponentLink1URL: https://www.molex.com/content/dam/molex/molex-dot-com/products/automated/en-us/salesdrawingpdf/637/6373/022232021_sd.pdf?inline; ComponentLink2Description: Supplier1; ComponentLink2URL: https://www.digikey.com/en/products/detail/molex/0022232021/26667; MP: 0022232021
Q1 = AO3400A: MOSFET N-CH 30V SOT-23-3L; MF: AOS; ComponentLink1Description: Supplier1; ComponentLink1URL: https://www.lcsc.com/product-detail/C20917.html; ComponentLink2Description: Datasheet; ComponentLink2URL: https://www.lcsc.com/datasheet/C20917.pdf; MP: AO3400A
R9-R11 = Res: as R5 on sheet 3.3V Buck Converter; ComponentLink1Description: Datasheet; ComponentLink1URL: https://www.lcsc.com/datasheet/C2906982.pdf; ComponentLink2Description: Supplier1; ComponentLink2URL: https://www.lcsc.com/product-detail/C2906982.html
U4 = A1308LLHLX-05-T Magnetometer: SOT-23W Linear 0.5mV/Gauss, Compass (ICs) RoHS; MF: ALLEGRO; ComponentLink1Description: Datasheet; ComponentLink1URL: https://www.lcsc.com/datasheet/C2152984.pdf; ComponentLink2Description: Supplier1; ComponentLink2URL: https://www.lcsc.com/product-detail/C2152984.html?s_z=n_A1308LLHLX-05-T; MP: A1308LLHLX-05-T

## Sheet Parallel LED Strip Buck Converter.SchDoc
size A; SheetNumber: 3; SheetTotal: 19
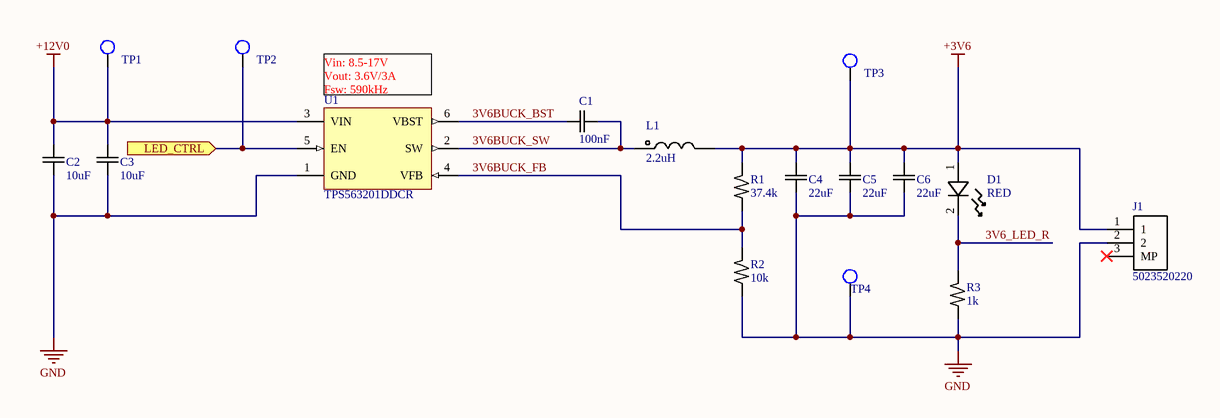
[diagram p8: Parallel LED Strip Buck Converter.SchDoc]

### Parts
C1  100nF  [C0603]
C2  10uF  [C1206]
C3  10uF  [C1206]
C4  22uF  [C1206]
C5  22uF  [C1206]
C6  22uF  [C1206]
D1  RED  [LED0805 RED]
J1  5023520220  [5600200220]
L1  2.2uH  [Coil 7.2x6.6]
R1  37.4k  [R0603]
R2  10k  [R0603]
R3  1k  [R0603]
TP1  TestPoint  [TESTPOINT_SMD_1.27MM]  (value not drawn)  (no BOM)
TP2  TestPoint  [TESTPOINT_SMD_1.27MM]  (value not drawn)  (no BOM)
TP3  TestPoint  [TESTPOINT_SMD_1.27MM]  (value not drawn)  (no BOM)
TP4  TestPoint  [TESTPOINT_SMD_1.27MM]  (value not drawn)  (no BOM)
U1  TPS563201DDCR  [SOT23-6]

### Ports
LED_CTRL (in)

### Nets
+3V6: C4.1 C5.1 C6.1 D1.1 J1.1 L1.2 R1.2 TP3.1
+12V0: C2.2 C3.2 TP1.1 U1.3(VIN)
GND: C2.1 C3.1 C4.2 C5.2 C6.2 J1.2 R2.1 R3.1 TP4.1 U1.1(GND)
3V6_LED_R: D1.2 R3.2
3V6BUCK_BST: C1.1 U1.6(VBST)
3V6BUCK_FB: R1.1 R2.2 U1.4(VFB)
3V6BUCK_SW: C1.2 L1.1 U1.2(SW)
NetTP2_1: TP2.1 U1.5(EN) ; port LED_CTRL

Not connected (* = marked no-connect by the designer): J1 3(MP)*

### Notes on the sheet
- (near U1) Vin: 8.5-17V
  Vout: 3.6V/3A
  Fsw: 590kHz
- Project:
- Sheet Title:
- Size
- Date:
- A
- Sheet Number:
- Sheet Total:
- Revision:
- Time:
- Author:

### Library data of the parts
C1 = Cap_cer: as C7 on sheet 3.3V Buck Converter; ComponentLink1Description: Datasheet; ComponentLink1URL: https://www.lcsc.com/datasheet/C6119867.pdf; ComponentLink2Description: Supplier1; ComponentLink2URL: https://www.lcsc.com/product-detail/C6119867.html
C2 C3 = Cap_cer: as C8 on sheet 3.3V Buck Converter; ComponentLink1Description: Datasheet; ComponentLink1URL: https://www.lcsc.com/datasheet/C513767.pdf; ComponentLink2Description: Supplier1; ComponentLink2URL: https://www.lcsc.com/product-detail/C513767.html
C4-C6 = Cap_cer: as C10 on sheet 3.3V Buck Converter; ComponentLink1Description: Datasheet; ComponentLink1URL: https://www.lcsc.com/datasheet/C20416445.pdf; ComponentLink2Description: Supplier1; ComponentLink2URL: https://www.lcsc.com/product-detail/C20416445.html
D1 = LED: as D2 on sheet 3.3V Buck Converter; ComponentLink1Description: Datasheet; ComponentLink1URL: https://www.lcsc.com/datasheet/C5349939.pdf; ComponentLink2Description: Supplier1; ComponentLink2URL: https://www.lcsc.com/product-detail/C5349939.html
J1 = 5023520202: as J2 on sheet CC Led Driver; MP: 5600200220; ComponentLink1Description: Supplier 1; ComponentLink1URL: https://www.lcsc.com/product-detail/C114092.html?s_z=n_5600200220; ComponentLink2Description: Datasheet; ComponentLink2URL: https://www.molex.com/content/dam/molex/molex-dot-com/products/automated/en-us/salesdrawingpdf/560/560020/5600200220_sd.pdf?inline\
L1 = Coil: as L2 on sheet 3.3V Buck Converter; ComponentLink1Description: Datasheet; ComponentLink1URL: https://www.lcsc.com/datasheet/C5189752.pdf; ComponentLink2Description: Supplier1; ComponentLink2URL: https://www.lcsc.com/product-detail/C5189752.html
R1 = Res: RES 37.4kΩ ±1% 100mW 0603; MF: FOJAN; MP: FRC0603F3742TS; ComponentLink1Description: Datasheet; ComponentLink1URL: https://www.lcsc.com/datasheet/C2933211.pdf; ComponentLink2Description: Supplier1; ComponentLink2URL: https://www.lcsc.com/product-detail/C2933211.html
R2 = Res: as R5 on sheet 3.3V Buck Converter; ComponentLink1Description: Datasheet; ComponentLink1URL: https://www.lcsc.com/datasheet/C2906982.pdf; ComponentLink2Description: Supplier1; ComponentLink2URL: https://www.lcsc.com/product-detail/C2906982.html
R3 = Res: as R6 on sheet 3.3V Buck Converter; ComponentLink1Description: Datasheet; ComponentLink1URL: https://www.lcsc.com/datasheet/C3017736.pdf; ComponentLink2Description: Supplier1; ComponentLink2URL: https://www.lcsc.com/product-detail/C3017736.html
U1 = TPS563201DDCR: as U2 on sheet 3.3V Buck Converter; ComponentLink1Description: Datasheet; ComponentLink1URL: https://www.lcsc.com/datasheet/C116592.pdf; ComponentLink2Description: Supplier1; ComponentLink2URL: https://www.lcsc.com/product-detail/C116592.html; MP: TPS563201DDCR

## Sheet Parallel PCU Test.SchDoc
size A; SheetNumber: 15; SheetTotal: 19
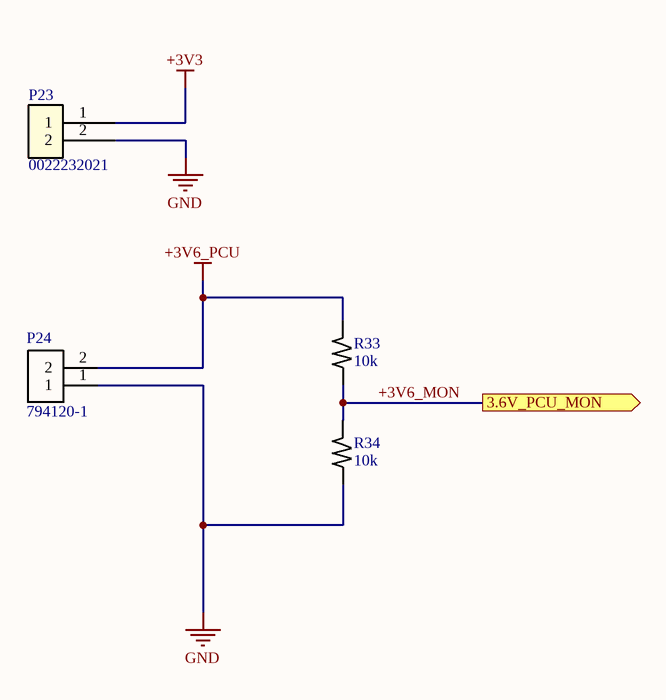
[diagram p9: Parallel PCU Test.SchDoc]

### Parts
P23  0022232021  [Signal2]
P24  794120-1  [POWER2-5.08 right angle]
R33  10k  [R0603]
R34  10k  [R0603]

### Ports
3.6V_PCU_MON (out)

### Nets
+3V3: P23.1
+3V6_PCU: P24.2 R33.2
GND: P23.2 P24.1 R34.1
+3V6_MON: R33.1 R34.2 ; port 3.6V_PCU_MON

### Notes on the sheet
- Project:
- Sheet Title:
- Size
- Date:
- A
- Sheet Number:
- Sheet Total:
- Revision:
- Time:
- Author:

### Library data of the parts
P23 = Signal2: SignalConnector, 2 leads; MF: Molex; ComponentLink1Description: Datasheet; ComponentLink1URL: https://www.molex.com/content/dam/molex/molex-dot-com/products/automated/en-us/salesdrawingpdf/637/6373/022232021_sd.pdf?inline; ComponentLink2Description: Supplier1; ComponentLink2URL: https://www.digikey.com/en/products/detail/molex/0022232021/26667; MP: 0022232021
P24 = Power2: as P1 on sheet Main; MF: 794120-1; ComponentLink1Description: Datasheet; ComponentLink1URL: https://www.te.com/commerce/DocumentDelivery/DDEController?Action=srchrtrv&DocNm=114-1012&DocType=Specification%20Or%20Standard&DocLang=English&DocFormat=pdf&PartCntxt=794120-1; ComponentLink2Description: Supplier1
R33 R34 = Res: as R5 on sheet 3.3V Buck Converter; ComponentLink1Description: Datasheet; ComponentLink1URL: https://www.lcsc.com/datasheet/C2906982.pdf; ComponentLink2Description: Supplier1; ComponentLink2URL: https://www.lcsc.com/product-detail/C2906982.html

## Sheet Power Supply Test.SchDoc
size A; SheetNumber: 14; SheetTotal: 19
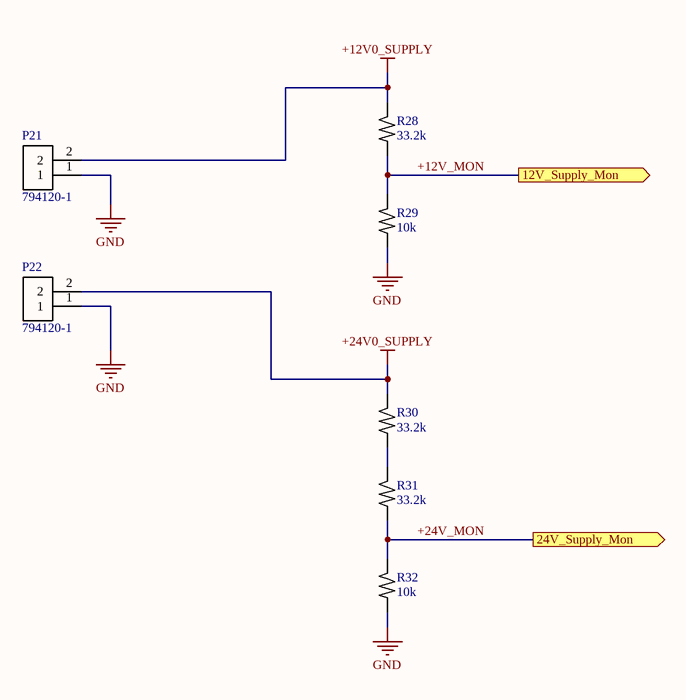
[diagram p10: Power Supply Test.SchDoc]

### Parts
P21  794120-1  [POWER2-5.08 right angle]
P22  794120-1  [POWER2-5.08 right angle]
R28  33.2k  [R0603]
R29  10k  [R0603]
R30  33.2k  [R0603]
R31  33.2k  [R0603]
R32  10k  [R0603]

### Ports
12V_Supply_Mon (out), 24V_Supply_Mon (out)

### Nets
+12V0_SUPPLY: P21.2 R28.2
+24V0_SUPPLY: P22.2 R30.2
GND: P21.1 P22.1 R29.1 R32.1
+12V_MON: R28.1 R29.2 ; port 12V_Supply_Mon
+24V_MON: R31.1 R32.2 ; port 24V_Supply_Mon
NetR30_1: R30.1 R31.2

### Notes on the sheet
- Project:
- Sheet Title:
- Size
- Date:
- A
- Sheet Number:
- Sheet Total:
- Revision:
- Time:
- Author:

### Library data of the parts
P21 P22 = Power2: as P1 on sheet Main; MF: 794120-1; ComponentLink1Description: Datasheet; ComponentLink1URL: https://www.te.com/commerce/DocumentDelivery/DDEController?Action=srchrtrv&DocNm=114-1012&DocType=Specification%20Or%20Standard&DocLang=English&DocFormat=pdf&PartCntxt=794120-1; ComponentLink2Description: Supplier1
R28 R30 R31 = Res: as R4 on sheet 3.3V Buck Converter; ComponentLink1Description: Datasheet; ComponentLink1URL: https://www.lcsc.com/datasheet/C2933200.pdf; ComponentLink2Description: Supplier1; ComponentLink2URL: https://www.lcsc.com/product-detail/C2933200.html
R29 R32 = Res: as R5 on sheet 3.3V Buck Converter; ComponentLink1Description: Datasheet; ComponentLink1URL: https://www.lcsc.com/datasheet/C2906982.pdf; ComponentLink2Description: Supplier1; ComponentLink2URL: https://www.lcsc.com/product-detail/C2906982.html

## Sheet PTC Heater Driver.SchDoc
size A; SheetNumber: 8; SheetTotal: 19
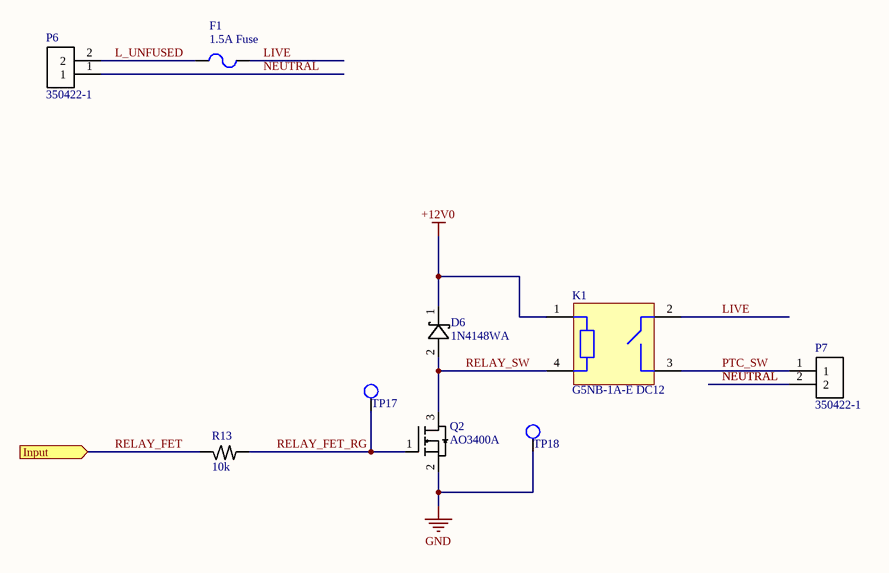
[diagram p11: PTC Heater Driver.SchDoc]

### Parts
D6  1N4148WA  [SOD-123W]
F1  1.5A Fuse  [2410 Fuse]
K1  G5NB-1A-E DC12  [G5NB-1A-E DC12 Relay]
P6  350422-1  [POWER2-5.08]
P7  350422-1  [POWER2-5.08]
Q2  AO3400A  [SOT23-3]
R13  10k  [R0603]
TP17  TestPoint  [TESTPOINT_SMD_1.27MM]  (value not drawn)  (no BOM)
TP18  TestPoint  [TESTPOINT_SMD_1.27MM]  (value not drawn)  (no BOM)

### Ports
Input (in)

### Nets
+12V0: D6.1 K1.1
GND: Q2.2(G) TP18.1
L_UNFUSED: F1.1 P6.2
LIVE: F1.2 K1.2
NEUTRAL: P6.1 P7.2
PTC_SW: K1.3 P7.1
RELAY_FET: R13.2 ; port Input
RELAY_FET_RG: Q2.1(G) R13.1 TP17.1
RELAY_SW: D6.2 K1.4 Q2.3(G)

### Notes on the sheet
- Project:
- Sheet Title:
- Size
- Date:
- A
- Sheet Number:
- Sheet Total:
- Revision:
- Time:
- Author:

### Library data of the parts
D6 = PMEG4020ETR-QX: DIODE GP 75V 150mA SOD-123W; MF: PJSEMI; MP: 1N4148WA; ComponentLink1Description: Datasheet; ComponentLink1URL: https://www.lcsc.com/datasheet/C2977359.pdf; ComponentLink2Description: Supplier1; ComponentLink2URL: https://www.lcsc.com/product-detail/C2977359.html
F1 = JFC2410-1150FS: FUSE BRD MNT 1.5A 250VAC/VDC 2410; MF: JDTfuse; ComponentLink1Description: Datasheet; ComponentLink1URL: https://www.lcsc.com/datasheet/C2994707.pdf; ComponentLink2Description: Supplier1; ComponentLink2URL: https://www.lcsc.com/product-detail/C2994707.html; MP: JFC2410-1150FS
K1 = G5NB-1A-E DC12 Relay: PCB Power Relay with 1-pole, 3A/5A Switching Capability and 10 kV Impulse Withstand Voltage; MF: OMRON; ComponentLink1Description: Datasheet; ComponentLink1URL: https://www.lcsc.com/datasheet/C225714.pdf; ComponentLink2Description: Supplier1; ComponentLink2URL: https://www.lcsc.com/product-detail/C225714.html; MP: G5NB-1A-E DC12
P6 P7 = Power2: PCB Mount Header, Vertical, Wire-to-Board, 2 Position, 5.08 mm [.2 in] Centerline, Fully Shrouded, Pre-Tin, Commercial MATE-N-LOK; MF: TE Connectivity; MP: 350422-1; ComponentLink1Description: Datasheet; ComponentLink1URL: https://www.te.com/commerce/DocumentDelivery/DDEController?Action=srchrtrv&DocNm=114-1012&DocType=Specification%20Or%20Standard&DocLang=English&DocFormat=pdf&PartCntxt=350422-1; ComponentLink2Description: Supplier1
Q2 = AO3400A: MOSFET N-CH 30V SOT-23-3L; MF: AOS; ComponentLink1Description: Supplier1; ComponentLink1URL: https://www.lcsc.com/product-detail/C20917.html; ComponentLink2Description: Datasheet; ComponentLink2URL: https://www.lcsc.com/datasheet/C20917.pdf; MP: AO3400A
R13 = Res: as R5 on sheet 3.3V Buck Converter; ComponentLink1Description: Datasheet; ComponentLink1URL: https://www.lcsc.com/datasheet/C2906982.pdf; ComponentLink2Description: Supplier1; ComponentLink2URL: https://www.lcsc.com/product-detail/C2906982.html

## Sheet RS-485 Transceiver.SchDoc
size A; SheetNumber: 18; SheetTotal: 19
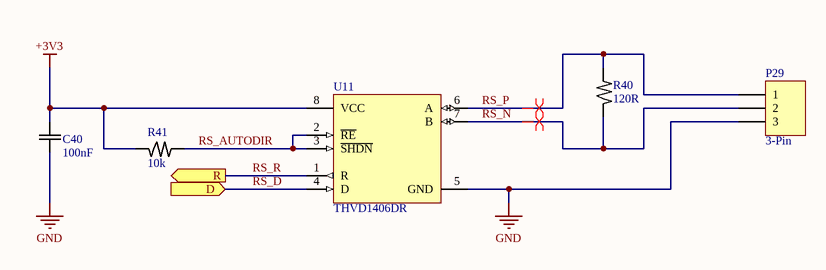
[diagram p12: RS-485 Transceiver.SchDoc]

### Parts
C40  100nF  [C0603]
P29  3-Pin  [Spring Terminal Block 3-Pin]
R40  120R  [R0603]
R41  10k  [R0603]
U11  THVD1406DR  [SOIC-8]

### Ports
D (in), R (out)

### Nets
+3V3: C40.2 R41.2 U11.8(VCC)
GND: C40.1 P29.3 U11.5(GND)
RS_AUTODIR: R41.1 U11.2(~{RE}) U11.3(~{SHDN})
RS_D: U11.4(D) ; port D
RS_N: P29.2 R40.2 U11.7(B)
RS_P: P29.1 R40.1 U11.6(A)
RS_R: U11.1(R) ; port R

### Layout directives
differential pair: RS_N, RS_P

### Notes on the sheet
- Project:
- Sheet Title:
- Size
- Date:
- A
- Sheet Number:
- Sheet Total:
- Revision:
- Time:
- Author:

### Library data of the parts
C40 = Cap_cer: as C7 on sheet 3.3V Buck Converter; ComponentLink1Description: Datasheet; ComponentLink1URL: https://www.lcsc.com/datasheet/C6119867.pdf; ComponentLink2Description: Supplier1; ComponentLink2URL: https://www.lcsc.com/product-detail/C6119867.html
P29 = Spring Terminal 3-Pin: 3 Position Wire to Board Terminal Block 2.54mm Through Hole, Right Angle; MF: DORABO; MP: DB141R-2.54-3P-GN; ComponentLink1Description: Datasheet; ComponentLink1URL: https://www.lcsc.com/datasheet/C2898755.pdf; ComponentLink2Description: Supplier1; ComponentLink2URL: https://www.lcsc.com/product-detail/C2898755.html?s_z=n_C2898755
R40 = Res: RES 120Ω ±1% 100mW 0603; MF: UNI-ROYAL; MP: 0603WAF1200T5E; ComponentLink1Description: Datasheet; ComponentLink1URL: https://www.lcsc.com/datasheet/C22787.pdf; ComponentLink2Description: Supplier1; ComponentLink2URL: https://www.lcsc.com/product-detail/C22787.html
R41 = Res: as R5 on sheet 3.3V Buck Converter; ComponentLink1Description: Datasheet; ComponentLink1URL: https://www.lcsc.com/datasheet/C2906982.pdf; ComponentLink2Description: Supplier1; ComponentLink2URL: https://www.lcsc.com/product-detail/C2906982.html
U11 = THVD1406DR RS-485: 1/1 Transceiver Half RS422, RS485 SOIC-8; MF: Texas Instruments; MP: THVD1406DR; ComponentLink1Description: Supplier1; ComponentLink1URL: https://www.lcsc.com/product-detail/C5215918.html?s_z=n_C5215918; ComponentLink2Description: Datasheet; ComponentLink2URL: https://www.ti.com/lit/ds/symlink/thvd1406.pdf?ts=1766398260594

## Sheet Sensors Test.SchDoc
size A; SheetNumber: 13; SheetTotal: 19
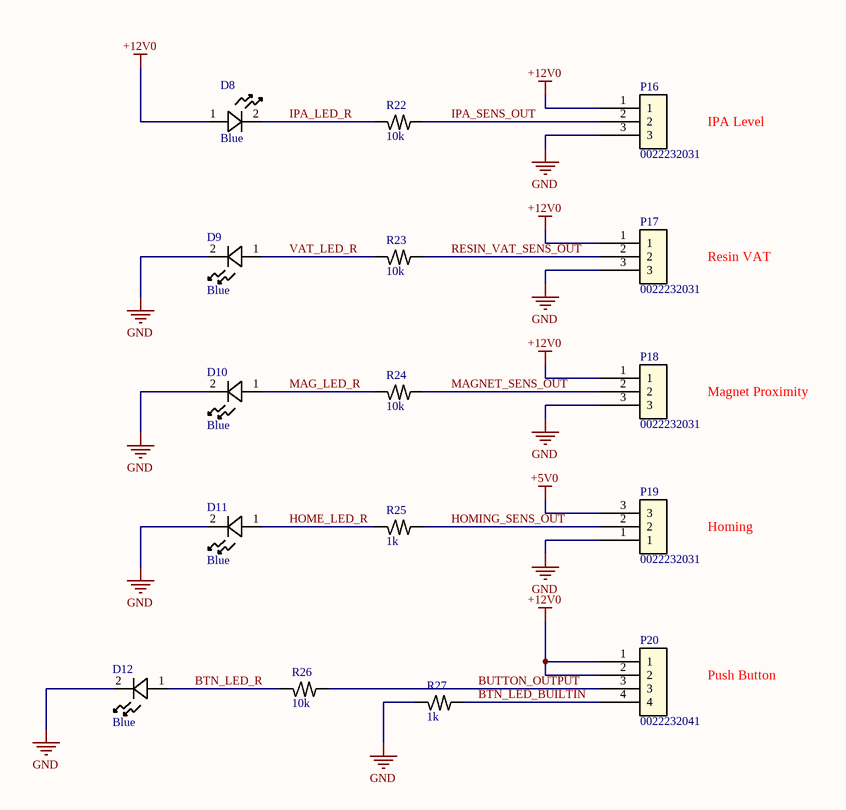
[diagram p13: Sensors Test.SchDoc]

### Parts
D8  Blue  [LED0805 BLUE]
D9  Blue  [LED0805 BLUE]
D10  Blue  [LED0805 BLUE]
D11  Blue  [LED0805 BLUE]
D12  Blue  [LED0805 BLUE]
P16  0022232031  [Signal3]
P17  0022232031  [Signal3]
P18  0022232031  [Signal3]
P19  0022232031  [Signal3]
P20  0022232041  [Signal4]
R22  10k  [R0603]
R23  10k  [R0603]
R24  10k  [R0603]
R25  1k  [R0603]
R26  10k  [R0603]
R27  1k  [R0603]

### Nets
+5V0: P19.3
+12V0: D8.1 P16.1 P17.1 P18.1 P20.1 P20.2
GND: D9.2 D10.2 D11.2 D12.2 P16.3 P17.3 P18.3 P19.1 R27.2
BTN_LED_BUILTIN: P20.4 R27.1
BTN_LED_R: D12.1 R26.2
BUTTON_OUTPUT: P20.3 R26.1
HOME_LED_R: D11.1 R25.2
HOMING_SENS_OUT: P19.2 R25.1
IPA_LED_R: D8.2 R22.2
IPA_SENS_OUT: P16.2 R22.1
MAG_LED_R: D10.1 R24.2
MAGNET_SENS_OUT: P18.2 R24.1
RESIN_VAT_SENS_OUT: P17.2 R23.1
VAT_LED_R: D9.1 R23.2

### Notes on the sheet
- IPA Level
- Resin VAT
- Magnet Proximity
- Homing
- Push Button
- Project:
- Sheet Title:
- Size
- Date:
- A
- Sheet Number:
- Sheet Total:
- Revision:
- Time:
- Author:

### Library data of the parts
D8-D12 = LED: LED BLUE WATER CLEAR 0805 SMD; MF: XINGLIGHT; MP: XL-TD2012UBC; ComponentLink1Description: Datasheet; ComponentLink1URL: https://www.lcsc.com/datasheet/C5349940.pdf; ComponentLink2Description: Supplier1; ComponentLink2URL: https://www.lcsc.com/product-detail/C5349940.html
P16-P19 = Signal3: SignalConnector, 3 leads; MF: Molex; MP: 0022232031; ComponentLink1Description: Datasheet; ComponentLink1URL: https://tools.molex.com/pdm_docs/sd/022232031_sd.pdf; ComponentLink2Description: Supplier1; ComponentLink2URL: https://www.digikey.com/en/products/detail/molex/0022232031/26669
P20 = Signal4: SignalConnector, 4 leads; MF: Molex; ComponentLink1Description: Datasheet; ComponentLink1URL: https://tools.molex.com/pdm_docs/ps/PS-10-07-001.pdf; ComponentLink2Description: Supplier1; ComponentLink2URL: https://www.digikey.com/en/products/detail/molex/0022232041/26671; MP: 0022232041
R22-R24 R26 = Res: as R5 on sheet 3.3V Buck Converter; ComponentLink1Description: Datasheet; ComponentLink1URL: https://www.lcsc.com/datasheet/C2906982.pdf; ComponentLink2Description: Supplier1; ComponentLink2URL: https://www.lcsc.com/product-detail/C2906982.html
R25 R27 = Res: as R6 on sheet 3.3V Buck Converter; ComponentLink1Description: Datasheet; ComponentLink1URL: https://www.lcsc.com/datasheet/C3017736.pdf; ComponentLink2Description: Supplier1; ComponentLink2URL: https://www.lcsc.com/product-detail/C3017736.html

## Sheet Stepper Driver.SchDoc
size A; SheetNumber: 9; SheetTotal: 19
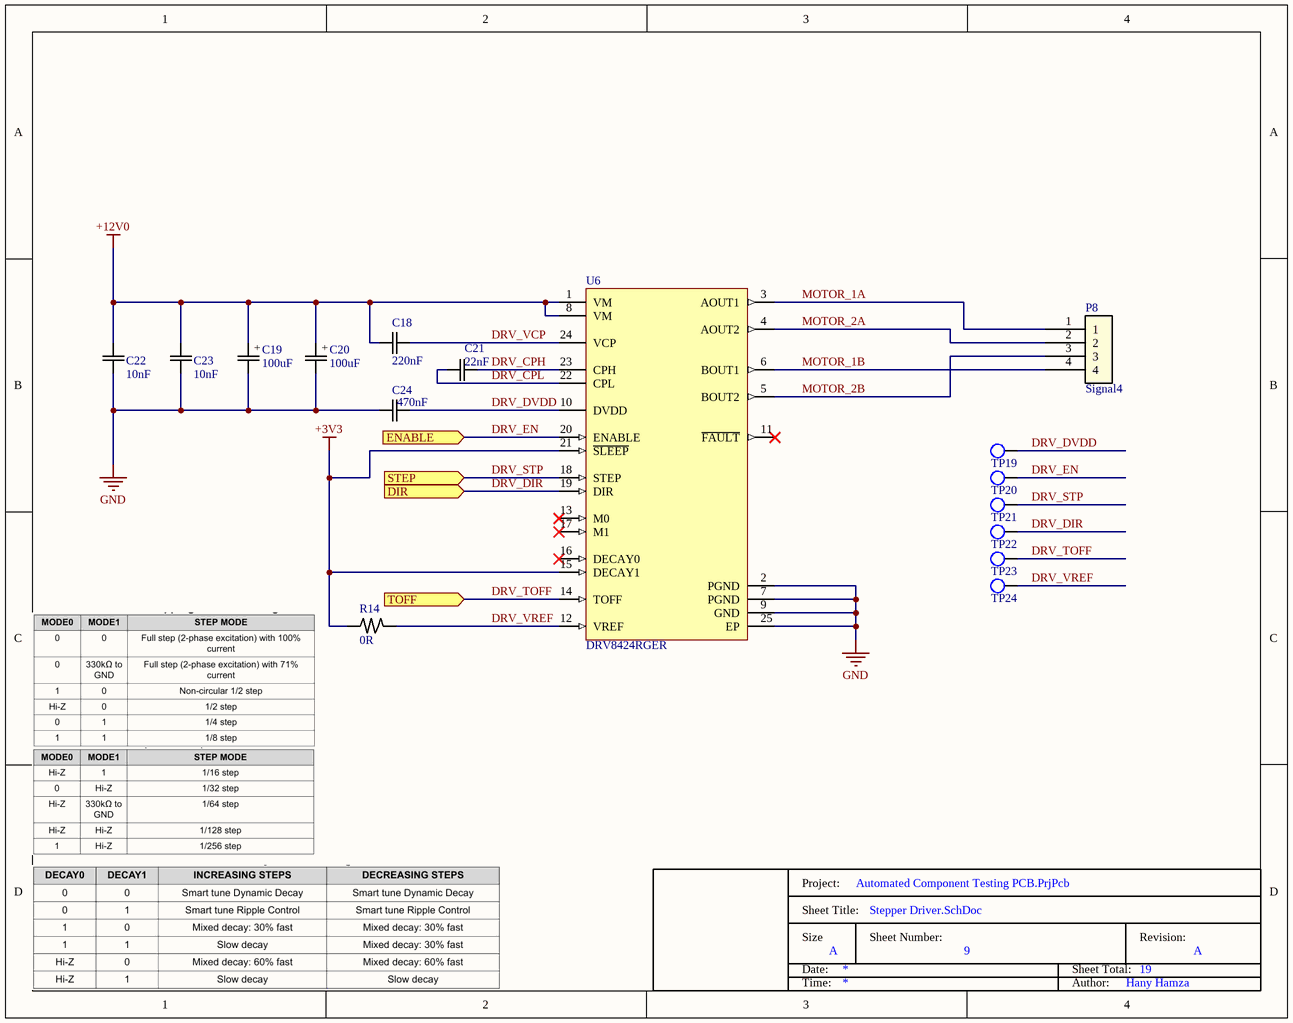
[diagram p14: Stepper Driver.SchDoc]

### Parts
C18  220nF  [C0603]
C19  100uF  [CAP THT D6.3mm]
C20  100uF  [CAP THT D6.3mm]
C21  22nF  [C0603]
C22  10nF  [C0603]
C23  10nF  [C0603]
C24  470nF  [C0603]
P8  Signal4  [Signal4]
R14  0R  [R0603]
TP19  TestPoint  [TESTPOINT_SMD_1.27MM]  (value not drawn)  (no BOM)
TP20  TestPoint  [TESTPOINT_SMD_1.27MM]  (value not drawn)  (no BOM)
TP21  TestPoint  [TESTPOINT_SMD_1.27MM]  (value not drawn)  (no BOM)
TP22  TestPoint  [TESTPOINT_SMD_1.27MM]  (value not drawn)  (no BOM)
TP23  TestPoint  [TESTPOINT_SMD_1.27MM]  (value not drawn)  (no BOM)
TP24  TestPoint  [TESTPOINT_SMD_1.27MM]  (value not drawn)  (no BOM)
U6  DRV8424RGER  [DRV8425RGER]

### Ports
DIR (in), ENABLE (in), STEP (in), TOFF (in)

### Nets
+3V3: R14.1 U6.15(DECAY1) U6.21(~{SLEEP})
+12V0: C18.1 C19.1(+) C20.1(+) C22.1 C23.1 U6.1(VM) U6.8(VM)
GND: C19.2(-) C20.2(-) C22.2 C23.2 C24.1 U6.2(PGND) U6.7(PGND) U6.9(GND) U6.25(EP)
DRV_CPH: C21.2 U6.23(CPH)
DRV_CPL: C21.1 U6.22(CPL)
DRV_DIR: TP22.1 U6.19(DIR) ; port DIR
DRV_DVDD: C24.2 TP19.1 U6.10(DVDD)
DRV_EN: TP20.1 U6.20(ENABLE) ; port ENABLE
DRV_STP: TP21.1 U6.18(STEP) ; port STEP
DRV_TOFF: TP23.1 U6.14(TOFF) ; port TOFF
DRV_VCP: C18.2 U6.24(VCP)
DRV_VREF: R14.2 TP24.1 U6.12(VREF)
MOTOR_1A: P8.1 U6.3(AOUT1)
MOTOR_1B: P8.4 U6.6(BOUT1)
MOTOR_2A: P8.2 U6.4(AOUT2)
MOTOR_2B: P8.3 U6.5(BOUT2)

Not connected (* = marked no-connect by the designer): U6 11(~{FAULT})* 13(M0)* 16(DECAY0)* 17(M1)*

### Notes on the sheet
- Project:
- Sheet Title:
- Size
- Date:
- A
- Sheet Number:
- Sheet Total:
- Revision:
- Time:
- Author:

### Library data of the parts
C18 = Cap_cer: CAP CER 220nF 50V X7R 0603; MF: HRE; MP: CGA0603X7R224K500JT; ComponentLink1Description: Datasheet; ComponentLink1URL: https://www.lcsc.com/datasheet/C6119835.pdf; ComponentLink2Description: Supplier1; ComponentLink2URL: https://www.lcsc.com/product-detail/C6119835.html
C19 C20 = Cap_alu: CAP ALUM 100uF ±20% 16V TH; MF: Lelon; MP: SSG101M1CBK-0605; ComponentLink1Description: Datasheet; ComponentLink1URL: https://www.lcsc.com/datasheet/C311658.pdf; ComponentLink2Description: Supplier1; ComponentLink2URL: https://www.lcsc.com/product-detail/C311658.html
C21 = Cap_cer: CAP CER 22nF 50V X7R 0603; MF: CCTC; MP: TCC0603X7R223M500CT; ComponentLink1Description: Datasheet; ComponentLink1URL: https://www.lcsc.com/datasheet/C696861.pdf; ComponentLink2Description: Supplier1; ComponentLink2URL: https://www.lcsc.com/product-detail/C696861.html
C22 C23 = Cap_cer: CAP CER 10nF 50V X7R 0603; MF: HRE; MP: CGA0603X7R103M500JT; ComponentLink1Description: Datasheet; ComponentLink1URL: https://www.lcsc.com/datasheet/C36911427.pdf; ComponentLink2Description: Supplier1; ComponentLink2URL: https://www.lcsc.com/product-detail/C36911427.html
C24 = Cap_cer: CAP CER 470nF 50V X7R 0603; MF: Chinocera; MP: HGC0603R7474K500NTHJ; ComponentLink1Description: Datasheet; ComponentLink1URL: https://www.lcsc.com/datasheet/C33546006.pdf; ComponentLink2Description: Supplier1; ComponentLink2URL: https://www.lcsc.com/product-detail/C33546006.html
P8 = Signal4: SignalConnector, 4 leads; MF: Molex; MP: 0022232041; ComponentLink1Description: Datasheet; ComponentLink1URL: https://tools.molex.com/pdm_docs/ps/PS-10-07-001.pdf; ComponentLink2Description: Supplier1; ComponentLink2URL: https://www.digikey.com/en/products/detail/molex/0022232041/26671
R14 = Res: RES 0Ω ±5% 100mW 0603; MF: VO; MP: SCR0603J0R; ComponentLink1Description: Datasheet; ComponentLink1URL: https://www.lcsc.com/datasheet/C3017805.pdf; ComponentLink2Description: Supplier1; ComponentLink2URL: https://www.lcsc.com/product-detail/C3017805.html
U6 = DRV8424RGER: Stepper Drivers With Integrated Current Sense, 1/256 Microstepping, STEP/DIR Interface and smart tune Technology; MF: Texas Instruments; ComponentLink1Description: Datasheet; ComponentLink1URL: https://www.lcsc.com/datasheet/C1518725.pdf; ComponentLink2Description: Supplier1; ComponentLink2URL: https://www.lcsc.com/product-detail/C1518725.html?s_z=n_DRV8424RGER; MP: DRV8424RGER

## Sheet STM32F103C8T6 MCU.SchDoc
size A; SheetNumber: 10; SheetTotal: 19
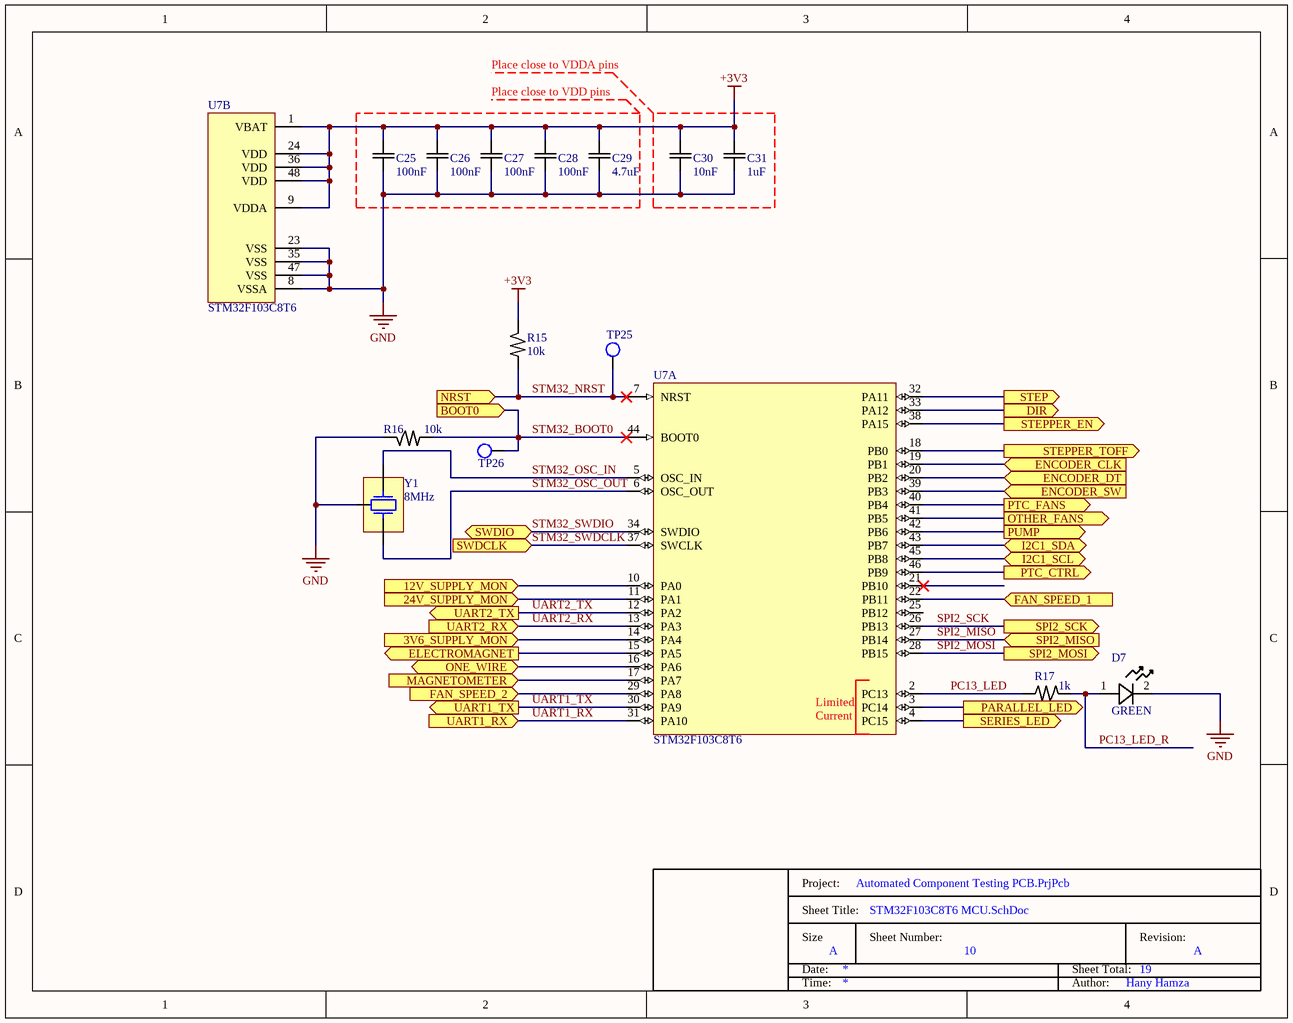
[diagram p15: STM32F103C8T6 MCU.SchDoc]

### Parts
C25  100nF  [C0603]
C26  100nF  [C0603]
C27  100nF  [C0603]
C28  100nF  [C0603]
C29  4.7uF  [C0603]
C30  10nF  [C0603]
C31  1uF  [C0603]
D7  GREEN  [LED0805 GREEN]
R15  10k  [R0603]
R16  10k  [R0603]
R17  1k  [R0603]
TP25  TestPoint  [TESTPOINT_SMD_1.27MM]  (value not drawn)  (no BOM)
TP26  TestPoint  [TESTPOINT_SMD_1.27MM]  (value not drawn)  (no BOM)
U7  STM32F103C8T6  [STM32-LQFP48]  (parts A,B of 2)
Y1  8MHz  [Resonator-SMD3213-3P]

### Blocks framed on the sheet
Place close to VDD pins: C25-C29

### Ports
3V6_SUPPLY_MON (in), 12V_SUPPLY_MON (in), 24V_SUPPLY_MON (in), BOOT0 (in), DIR (out), ELECTROMAGNET (out), ENCODER_CLK (in), ENCODER_DT (in), ENCODER_SW (in), FAN_SPEED_1 (in), FAN_SPEED_2 (in), I2C1_SCL (bidir), I2C1_SDA (bidir), MAGNETOMETER (in), NRST (in), ONE_WIRE (bidir), OTHER_FANS (out), PARALLEL_LED (out), PTC_CTRL (out), PTC_FANS (out), PUMP (out), SERIES_LED (out), SPI2_MISO (in), SPI2_MOSI (out), SPI2_SCK (out), STEP (out), STEPPER_EN (out), STEPPER_TOFF (out), SWDCLK (in), SWDIO (bidir), UART1_RX (in), UART1_TX (out), UART2_RX (in), UART2_TX (out)

### Nets
+3V3: C25.2 C26.2 C27.2 C28.2 C29.2 C30.1 C31.1 R15.2 U7.1(VBAT) U7.9(VDDA) U7.24(VDD) U7.36(VDD) U7.48(VDD)
GND: C25.1 C26.1 C27.1 C28.1 C29.1 C30.2 C31.2 D7.2 R16.2 U7.8(VSSA) U7.23(VSS) U7.35(VSS) U7.47(VSS) Y1.2
+3V6_MON: U7.14(PA4) ; port 3V6_SUPPLY_MON
+12V_MON: U7.10(PA0) ; port 12V_SUPPLY_MON
+24V_MON: U7.11(PA1) ; port 24V_SUPPLY_MON
DRV_DIR: U7.33(PA12) ; port DIR
DRV_EN: U7.38(PA15) ; port STEPPER_EN
DRV_STP: U7.32(PA11) ; port STEP
DRV_TOFF: U7.18(PB0) ; port STEPPER_TOFF
EM_FET: U7.15(PA5) ; port ELECTROMAGNET
ENCODER_A: U7.19(PB1) ; port ENCODER_CLK
ENCODER_B: U7.20(PB2) ; port ENCODER_DT
ENCODER_SW: U7.39(PB3) ; port ENCODER_SW
I2C_SCL: U7.45(PB8) ; port I2C1_SCL
I2C_SDA: U7.43(PB7) ; port I2C1_SDA
MAG_OUT: U7.17(PA7) ; port MAGNETOMETER
ONE_WIRE: U7.16(PA6) ; port ONE_WIRE
OTHER_FANS: U7.41(PB5) ; port OTHER_FANS
PC13_LED: R17.1 U7.2(PC13)
PC13_LED_R: D7.1 R17.2
PTC_FAN1_SPD: U7.22(PB11) ; port FAN_SPEED_1
PTC_FAN2_SPD: U7.29(PA8) ; port FAN_SPEED_2
PTC_FANS: U7.40(PB4) ; port PTC_FANS
PUMP_CTRL: U7.42(PB6) ; port PUMP
RELAY_FET: U7.46(PB9) ; port PTC_CTRL
SPI2_MISO: U7.27(PB14) ; port SPI2_MISO  [project net SO]
SPI2_MOSI: U7.28(PB15) ; port SPI2_MOSI
SPI2_SCK: U7.26(PB13) ; port SPI2_SCK  [project net SCK]
STM32_BOOT0: R16.1 TP26.1 U7.44(BOOT0) ; port BOOT0
STM32_NRST: R15.1 TP25.1 U7.7(NRST) ; port NRST
STM32_OSC_IN: U7.5(OSC_IN) Y1.1
STM32_OSC_OUT: U7.6(OSC_OUT) Y1.3
STM32_SWDCLK: U7.37(SWCLK) ; port SWDCLK  [project net STM32_SWCLK]
STM32_SWDIO: U7.34(SWDIO) ; port SWDIO
UART1_RX: U7.31(PA10) ; port UART1_RX
UART1_TX: U7.30(PA9) ; port UART1_TX
UART2_RX: U7.13(PA3) ; port UART2_RX  [project net RS_R]
UART2_TX: U7.12(PA2) ; port UART2_TX  [project net RS_D]
NetTP2_1: U7.3(PC14) ; port PARALLEL_LED
NetTP29_1: U7.4(PC15) ; port SERIES_LED

Not connected (* = marked no-connect by the designer): U7 21(PB10)* 25(PB12)

### Notes on the sheet
- Place close to VDDA pins
- Project:
- Sheet Title:
- Size
- Date:
- A
- Sheet Number:
- Sheet Total:
- Revision:
- Time:
- Author:
- (in symbol STM32F103C8T6, part A) Limited Current

### Library data of the parts
C25-C28 = Cap_cer: as C7 on sheet 3.3V Buck Converter; ComponentLink1Description: Datasheet; ComponentLink1URL: https://www.lcsc.com/datasheet/C6119867.pdf; ComponentLink2Description: Supplier1; ComponentLink2URL: https://www.lcsc.com/product-detail/C6119867.html
C29 = Cap_cer: 10V 4.7uF X7R ±10% 0603 Ceramic Capacitors ROHS; MF: Chinocera; MP: HGC0603R7475K100NTHJ; ComponentLink1Description: Datasheet; ComponentLink1URL: *; ComponentLink2Description: Supplier1; ComponentLink2URL: https://www.lcsc.com/product-detail/C49333234.html?s_z=n_HGC0603R7475K100NTHJ
C30 = Cap_cer: as C22 on sheet Stepper Driver; ComponentLink1Description: Datasheet; ComponentLink1URL: https://www.lcsc.com/datasheet/C36911427.pdf; ComponentLink2Description: Supplier1; ComponentLink2URL: https://www.lcsc.com/product-detail/C36911427.html
C31 = Cap_cer: 25V 1uF X7R ±10% 0603 Ceramic Capacitors ROHS; MF: Samsung Electro-Mechanics; MP: CL10B105KA8NNNC; ComponentLink1Description: Datasheet; ComponentLink1URL: https://www.lcsc.com/datasheet/C29936.pdf; ComponentLink2Description: Supplier1; ComponentLink2URL: https://www.lcsc.com/product-detail/C29936.html
D7 = LED: LED EMERALD GREEN WATER CLEAR 0805 SMD; MF: XINGLIGHT; MP: XL-TD2012UGC; ComponentLink1Description: Datasheet; ComponentLink1URL: https://www.lcsc.com/datasheet/C5349942.pdf; ComponentLink2Description: Supplier1; ComponentLink2URL: https://www.lcsc.com/product-detail/C5349942.html
R15 R16 = Res: as R5 on sheet 3.3V Buck Converter; ComponentLink1Description: Datasheet; ComponentLink1URL: https://www.lcsc.com/datasheet/C2906982.pdf; ComponentLink2Description: Supplier1; ComponentLink2URL: https://www.lcsc.com/product-detail/C2906982.html
R17 = Res: as R6 on sheet 3.3V Buck Converter; ComponentLink1Description: Datasheet; ComponentLink1URL: https://www.lcsc.com/datasheet/C3017736.pdf; ComponentLink2Description: Supplier1; ComponentLink2URL: https://www.lcsc.com/product-detail/C3017736.html
U7 = STM32F103C8T6: ARM-M3 72MHz 128Kb Flash 20Kb SRAM LQFP-48(7x7) Microcontrollers ROHS; MF: STMicroelectronics; MP: STM32F103C8T6; ComponentLink1Description: Datasheet; ComponentLink1URL: https://www.st.com/resource/en/datasheet/stm32f103c8.pdf; ComponentLink2Description: Supplier1; ComponentLink2URL: https://www.lcsc.com/product-detail/C8734.html?s_z=n_STM32F103C8T6
Y1 = Resonator: 8MHz 10pF 40Ω SMD3213-3P Resonators ROHS; MF: muRata; MP: CSTNE8M00G520000R0; ComponentLink1Description: Datasheet; ComponentLink1URL: https://www.lcsc.com/datasheet/C907975.pdf; ComponentLink2Description: Supplier1; ComponentLink2URL: https://www.lcsc.com/product-detail/C907975.html